# EAGLE board main_smd_smaller_draft (EAGLE 9.0.0)
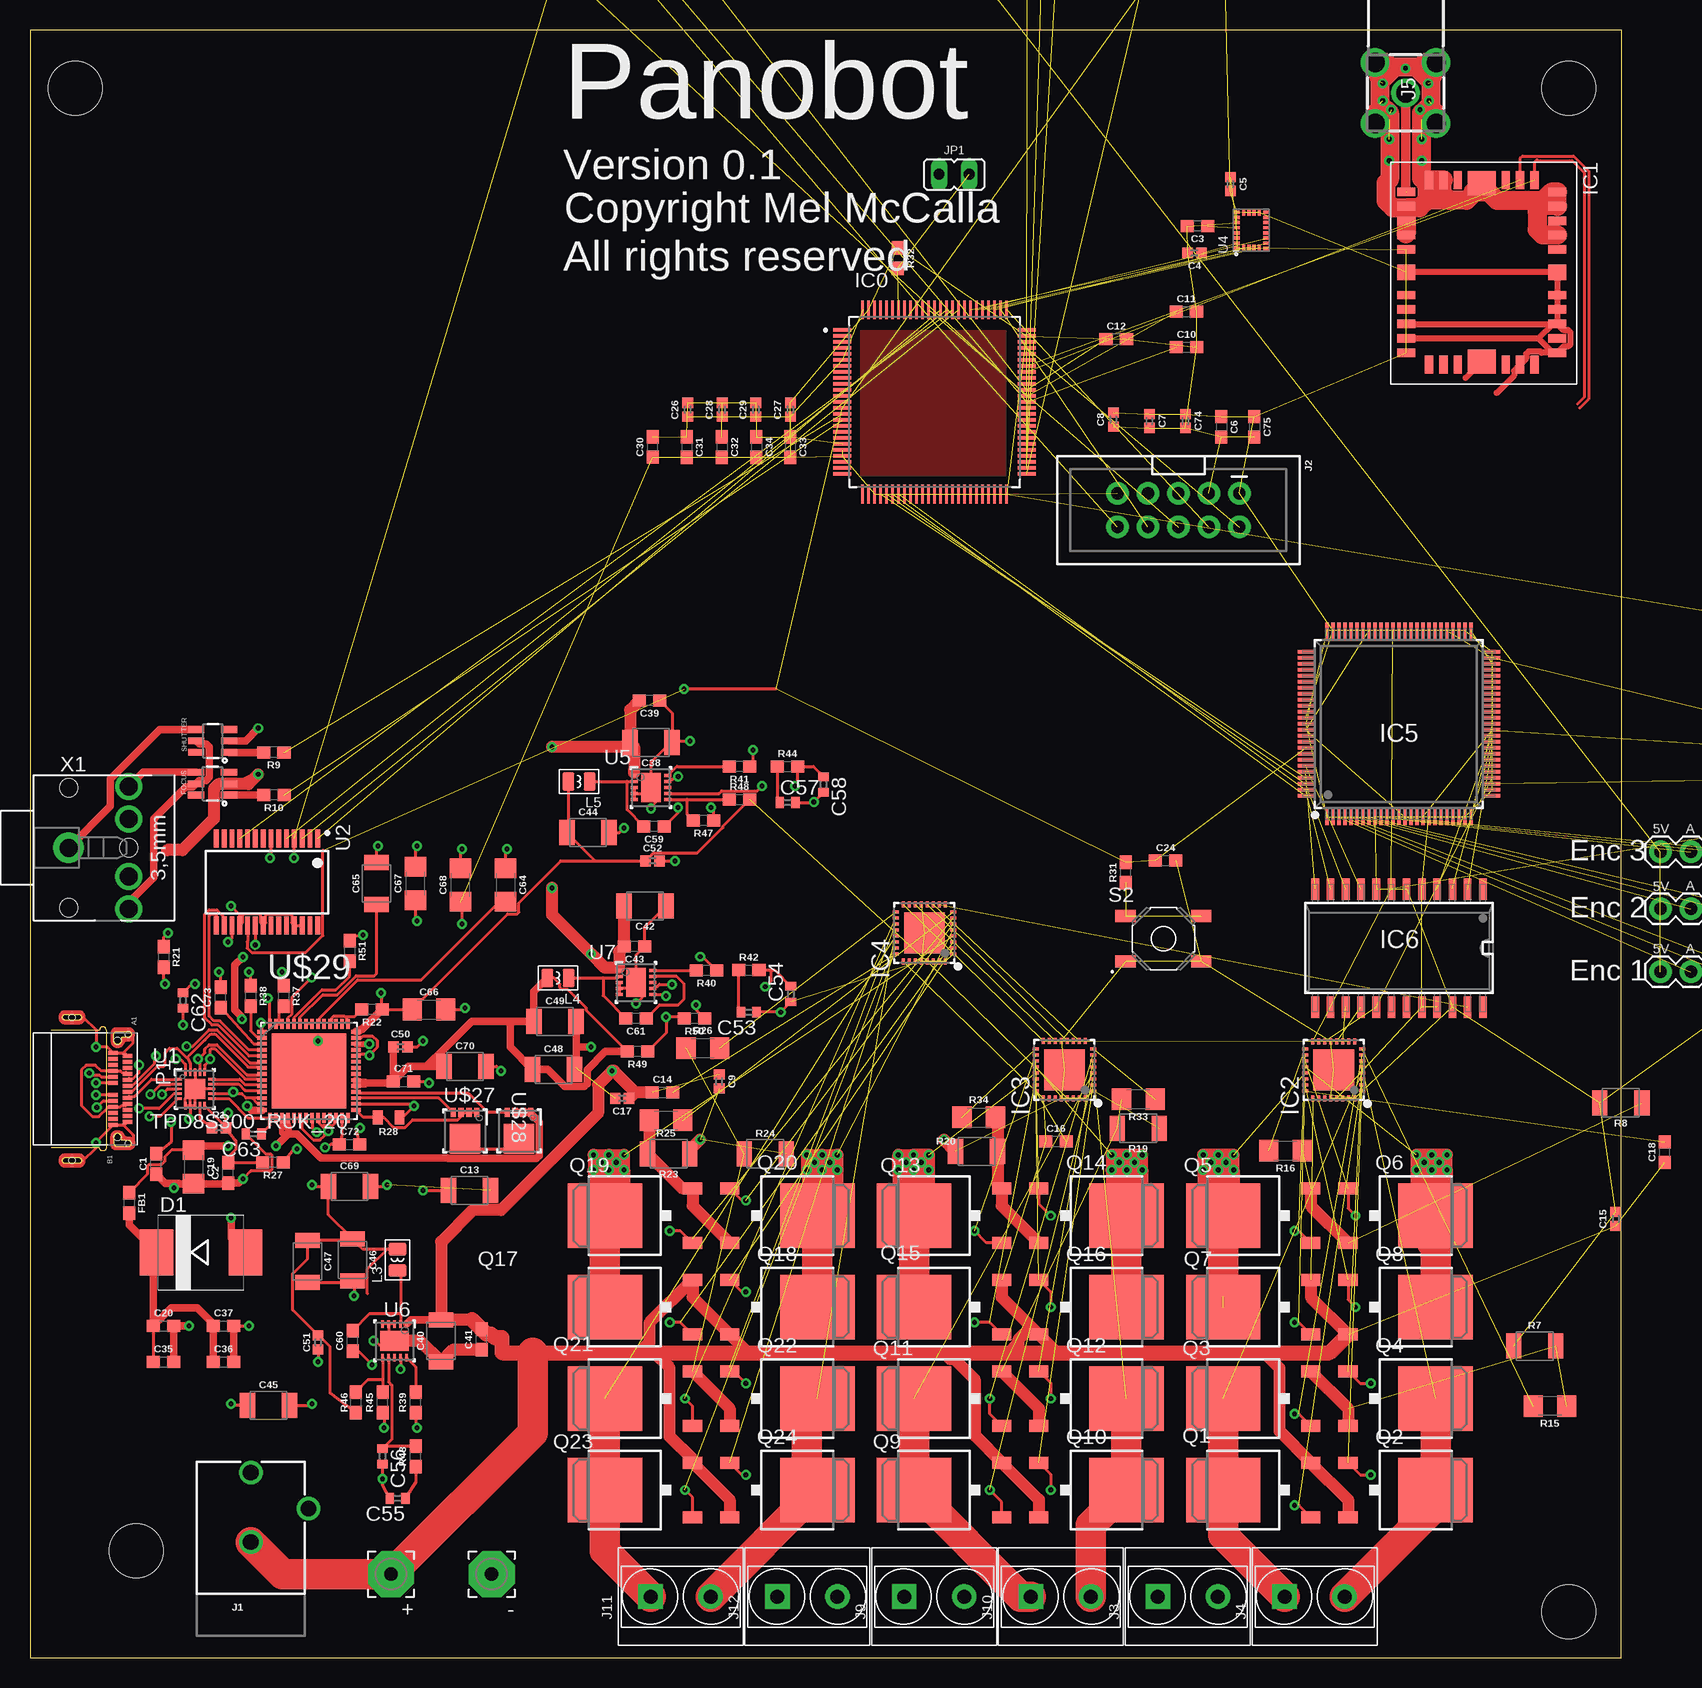
[diagram p9: board, top side]
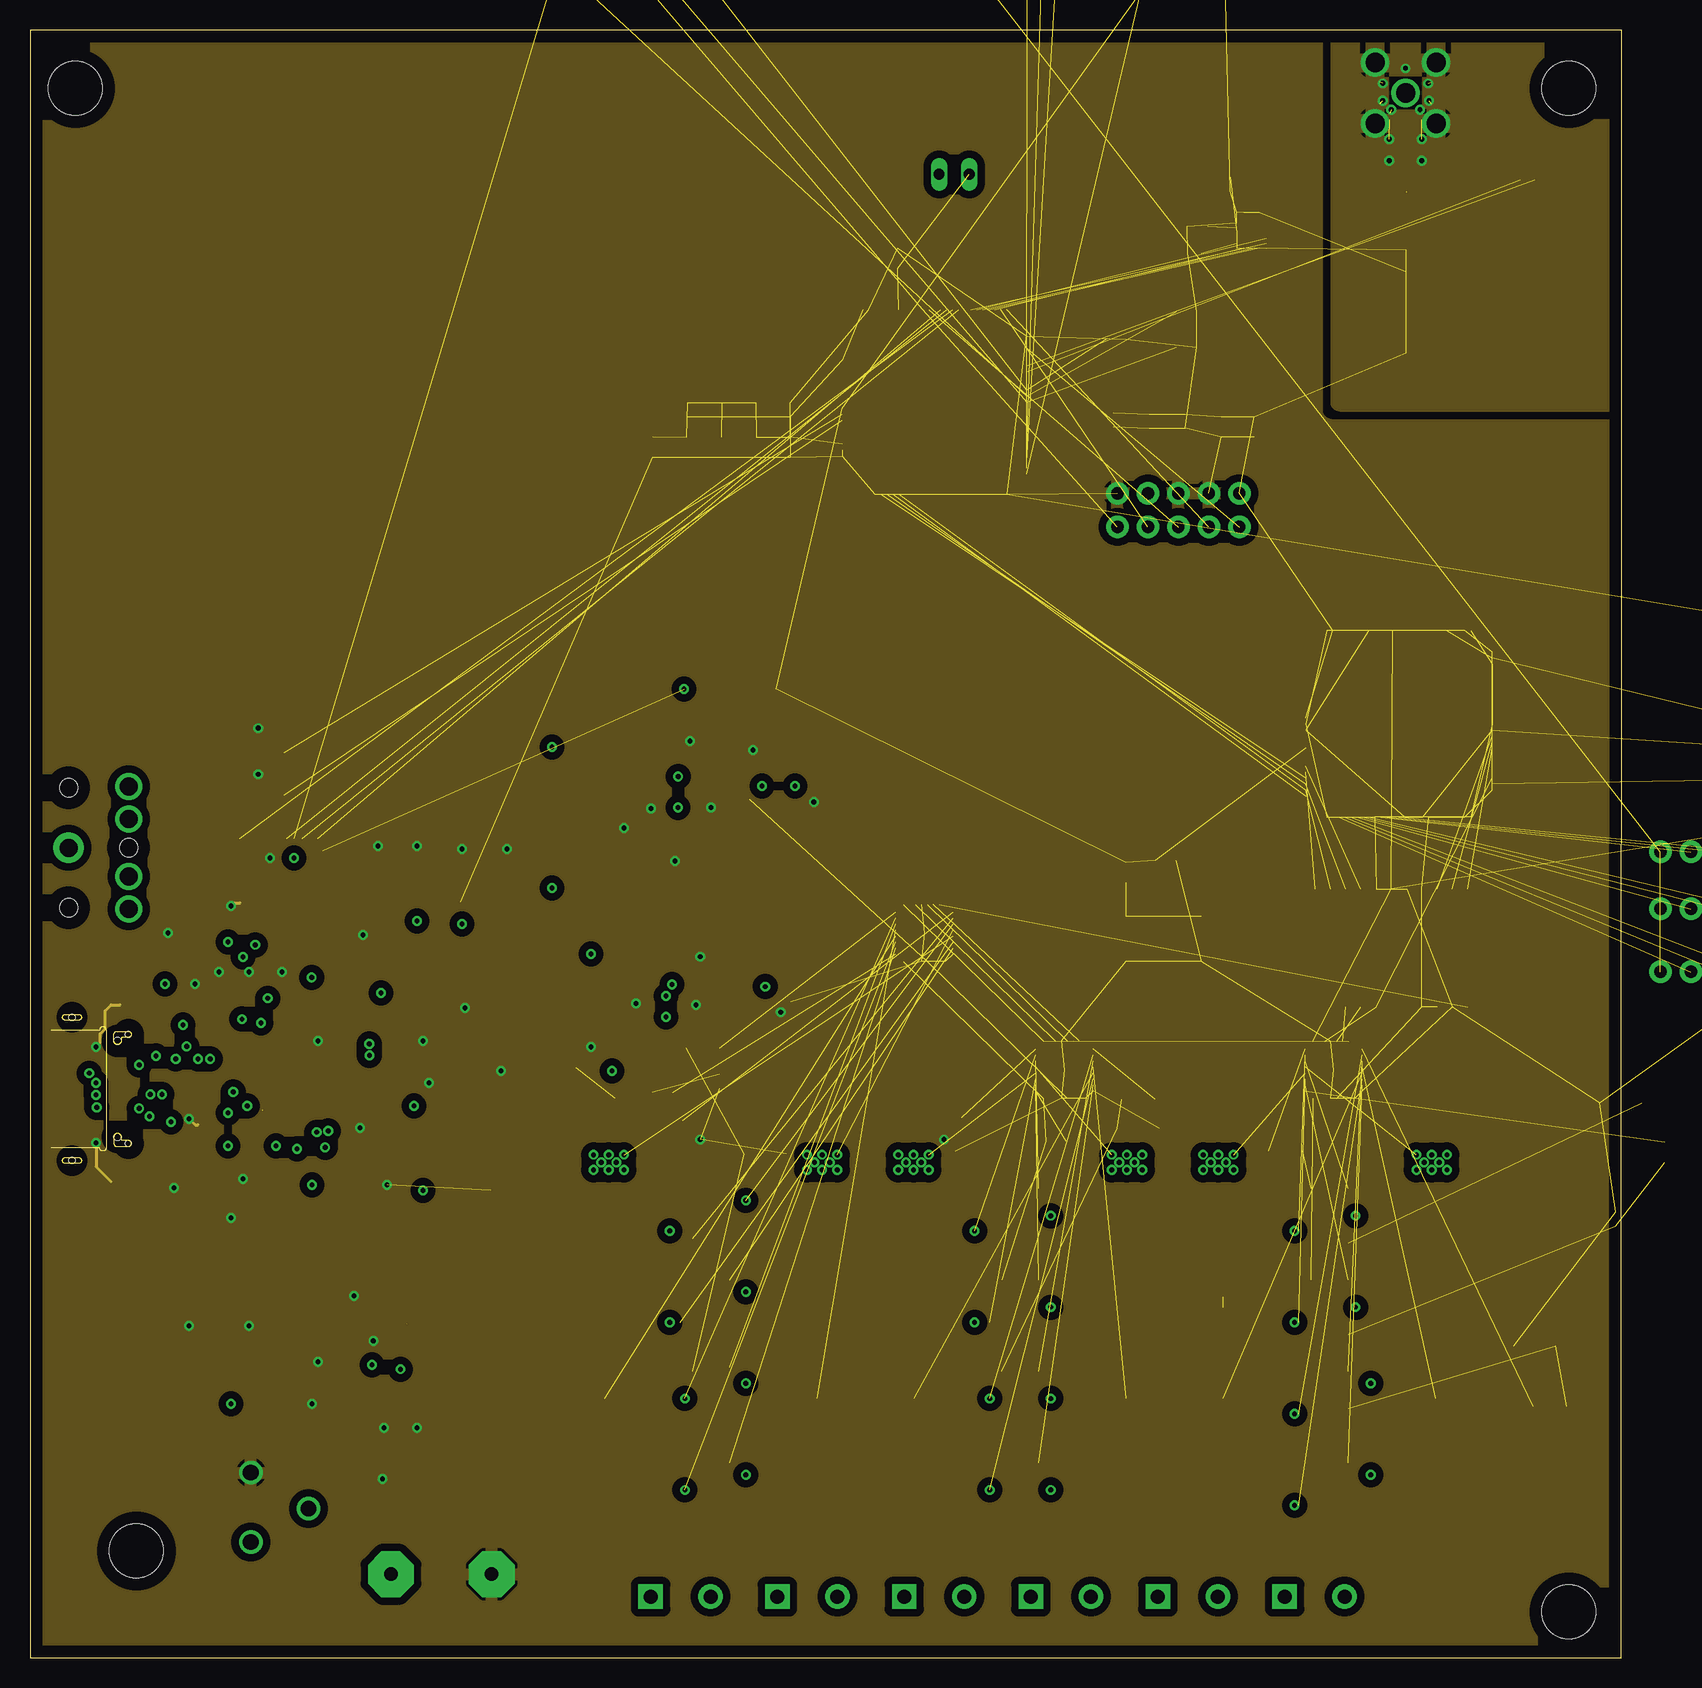
[diagram p10: board, inner layer Route2]
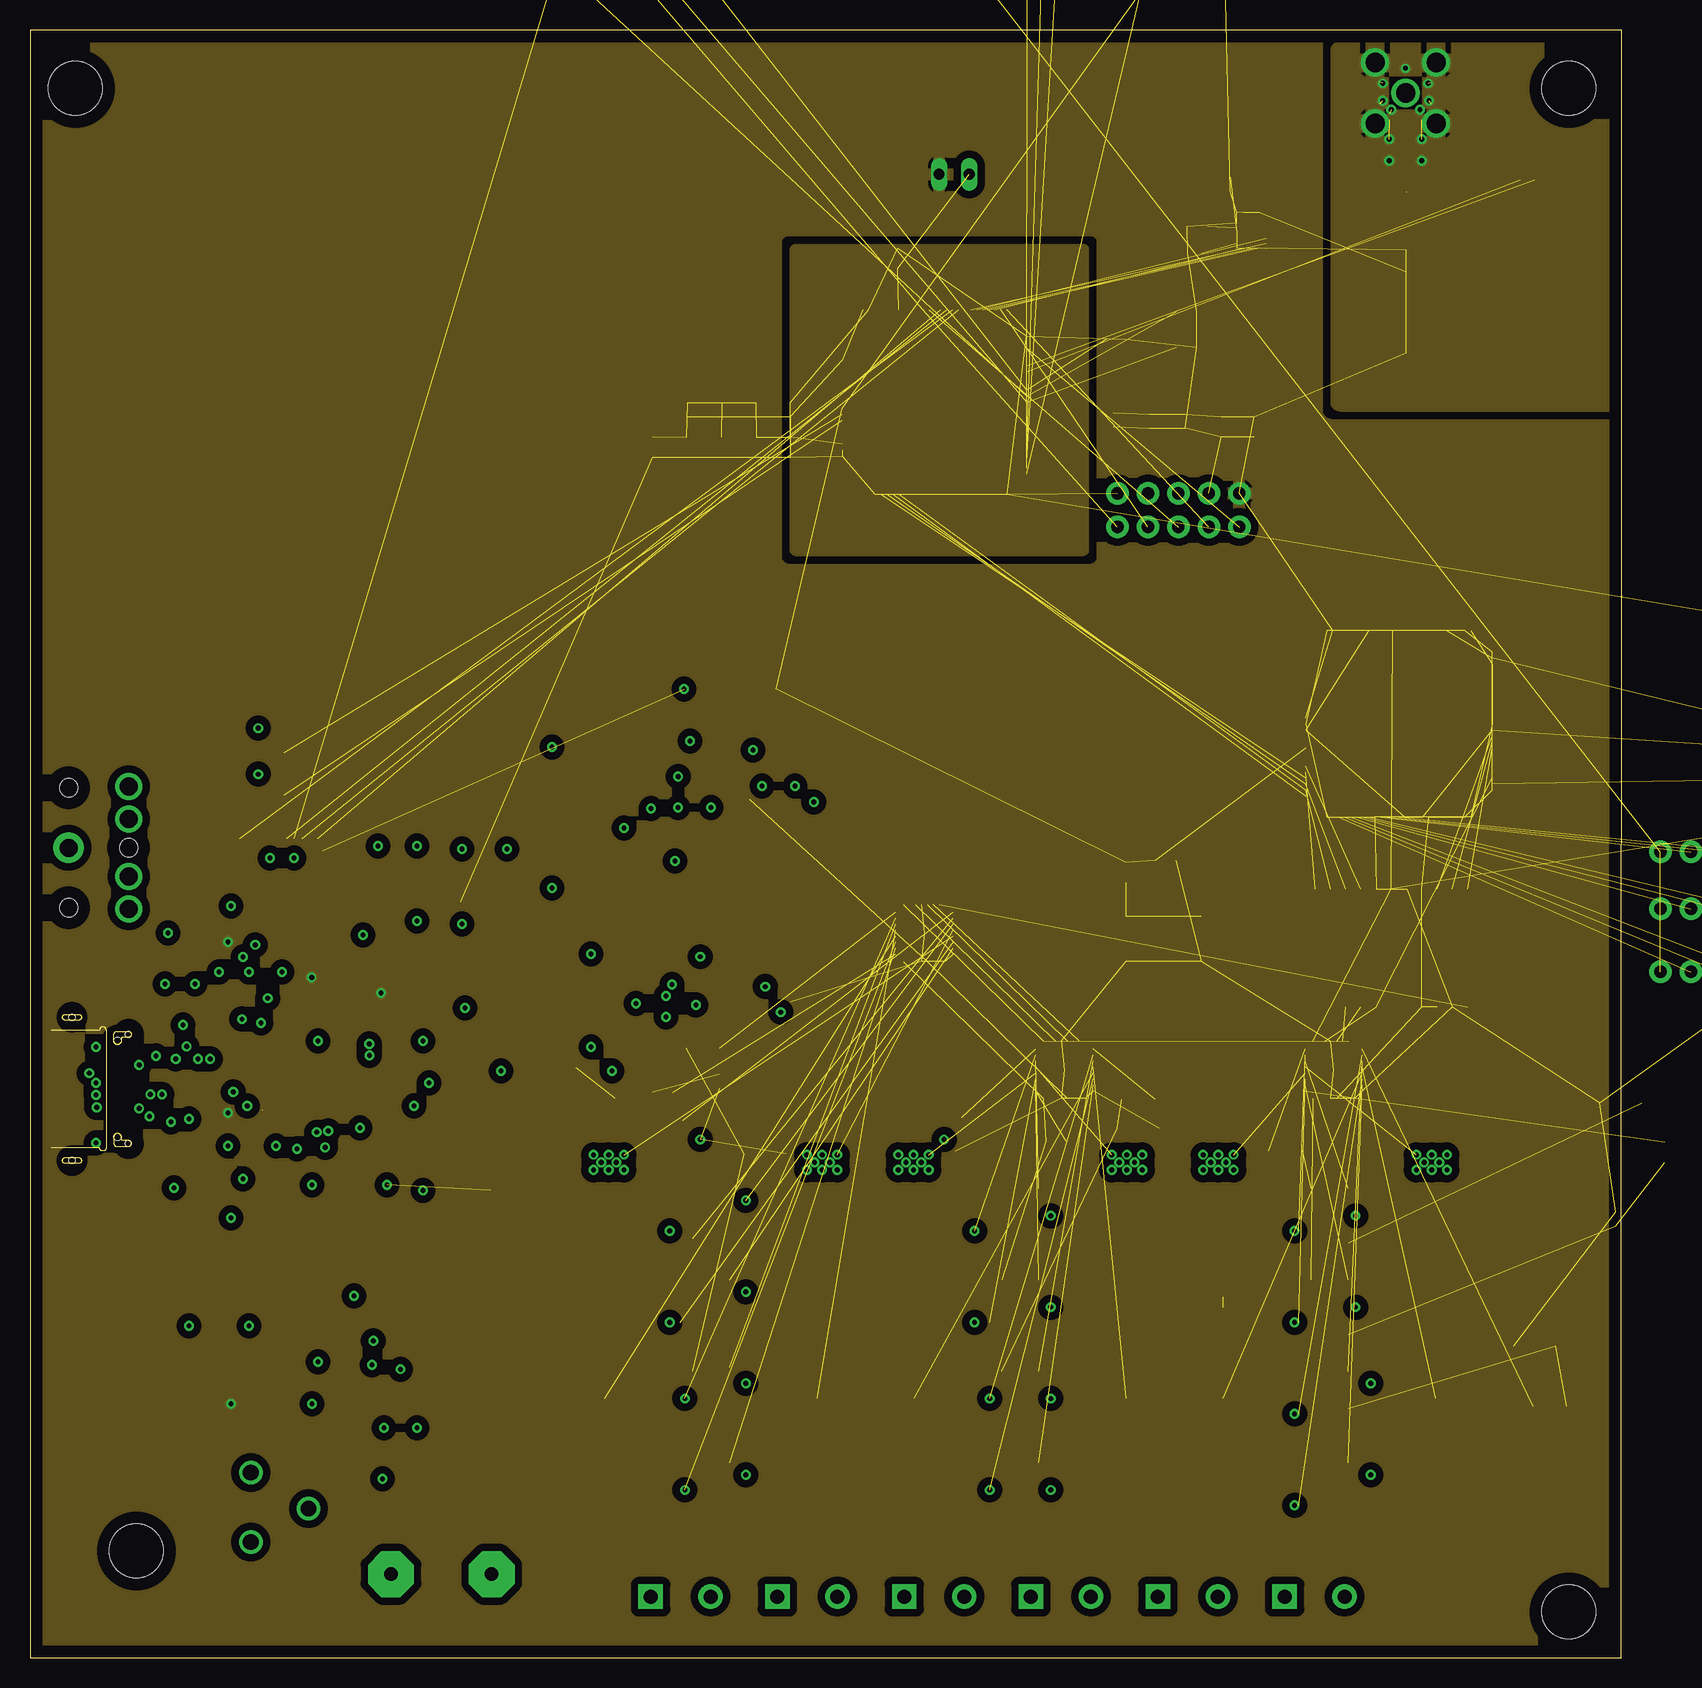
[diagram p11: board, inner layer Route3]
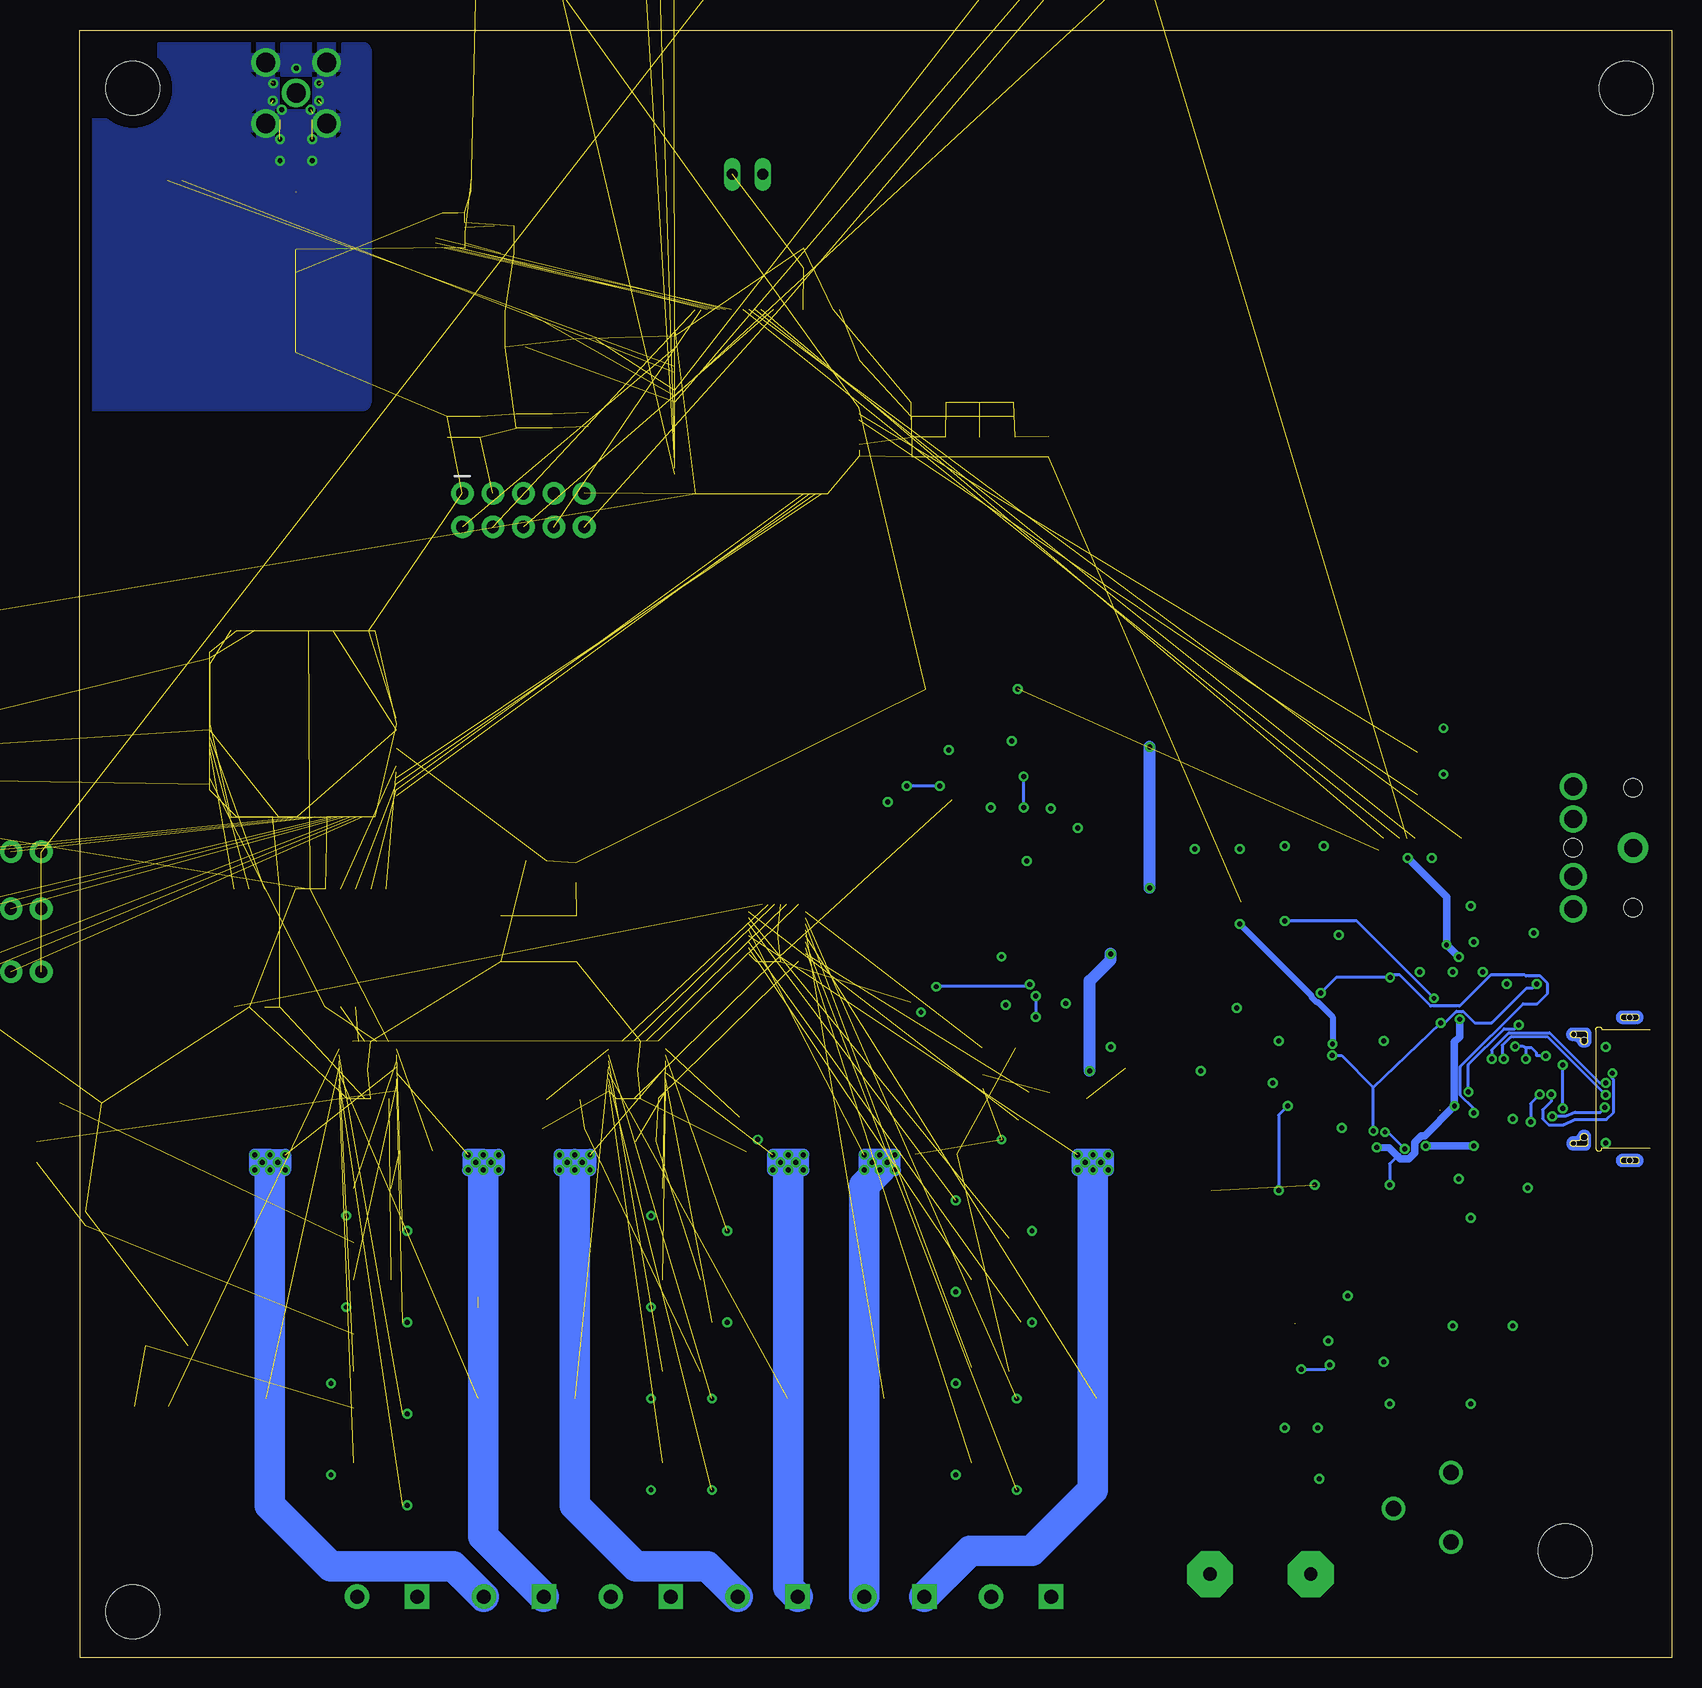
[diagram p12: board, bottom side, seen from below]

Size 132.66 x 135.67 mm. Coordinates in mm from the lower left corner, seen from the top.
Outline: 0,0 132.61,0 132.66,135.67 0,135.67 0,0
Copper layers (1+(2*3)+16): Top 0.035mm / dielectric 0.204mm / Route2 0.017mm / dielectric 0.252mm / Route3 0.017mm / dielectric 0.2mm / Bottom 0.035mm
Design rules "default *": minimum track width 3.5mil, minimum drill 16mil, track to track 3.5mil, track to pad 3.5mil, pad to pad 6mil, via to via 6mil, smd to smd 6mil, copper to edge 40mil, drill to drill 6mil, minimum pad ring 3mil, minimum via ring 8mil, stop-mask expansion 4mil, vias tented up to drill 0mil, thermal gap 10mil
Net classes: 1 differential: width 0.254 mm; 2 ground: width 0.254 mm; 3 power: width 0.254 mm; 4 rf: width 0.787 mm, clearance 0.152 mm; 5 rf_gnd: width 1.575 mm, clearance 0.152 mm
Holes 4.5 mm at 8.86,8.89 128.24,3.81 128.24,130.81 3.78,130.81

## Footprints (pad centres in the part's own frame; a part is rotated, then mirrored left to right if it is on the bottom)
3,81/1,1 = drill 1.118 pad 3.81 octagon: 1 0,0
0603 = smd 1.1 x 1: 1 -0.85,0; 2 0.85,0
0402 = smd 0.85 x 0.9: 1 -0.58,0; 2 0.58,0
1210 = smd 1.27 x 2.06: 1 -1.755,0; 2 1.755,0
1206 = smd 1.6 x 1.8: 1 -1.4,0; 2 1.4,0
C075-052X106 = drill 0.914 octagon: 1 -3.81,0; 2 3.81,0
085CS_1AR = smd 2.9 x 2.5: + 3.25,0; - -3.25,0
C0402 = smd 0.7 x 0.9: 1 -0.65,0; 2 0.65,0
SMC = smd 2.8 x 3.8: A 3.7,0; C -3.7,0
DO41-10 = drill 1.118: A 5.08,0; C -5.08,0
SOT23-6 = smd 0.55 x 1.35: 1 -0.95,-1.375; 2 0,-1.375; 3 0.95,-1.375; 4 0.95,1.375; 5 0,1.375; 6 -0.95,1.375
QFP50P1600X1600X160-100N = smd 1.56 x 0.28: 1 -7.68,6; 2 -7.68,5.5; 3 -7.68,5; 4 -7.68,4.5; 5 -7.68,4; 6 -7.68,3.5; 7 -7.68,3; 8 -7.68,2.5; 9 -7.68,2; 10 -7.68,1.5; 11 -7.68,1; 12 -7.68,0.5; 13 -7.68,0; 14 -7.68,-0.5; 15 -7.68,-1; 16 -7.68,-1.5; 17 -7.68,-2; 18 -7.68,-2.5; 19 -7.68,-3; 20 -7.68,-3.5; 21 -7.68,-4; 22 -7.68,-4.5; 23 -7.68,-5; 24 -7.68,-5.5; 25 -7.68,-6; 51 7.68,-6; 52 7.68,-5.5; 53 7.68,-5; 54 7.68,-4.5; 55 7.68,-4; 56 7.68,-3.5; 57 7.68,-3; 58 7.68,-2.5; 59 7.68,-2; 60 7.68,-1.5; 61 7.68,-1; 62 7.68,-0.5; 63 7.68,0; 64 7.68,0.5; 65 7.68,1; 66 7.68,1.5; 67 7.68,2; 68 7.68,2.5; 69 7.68,3; 70 7.68,3.5; 71 7.68,4; 72 7.68,4.5; 73 7.68,5; 74 7.68,5.5; 75 7.68,6 | smd 0.28 x 1.56: 26 -6,-7.68; 27 -5.5,-7.68; 28 -5,-7.68; 29 -4.5,-7.68; 30 -4,-7.68; 31 -3.5,-7.68; 32 -3,-7.68; 33 -2.5,-7.68; 34 -2,-7.68; 35 -1.5,-7.68; 36 -1,-7.68; 37 -0.5,-7.68; 38 0,-7.68; 39 0.5,-7.68; 40 1,-7.68; 41 1.5,-7.68; 42 2,-7.68; 43 2.5,-7.68; 44 3,-7.68; 45 3.5,-7.68; 46 4,-7.68; 47 4.5,-7.68; 48 5,-7.68; 49 5.5,-7.68; 50 6,-7.68; 76 6,7.68; 77 5.5,7.68; 78 5,7.68; 79 4.5,7.68; 80 4,7.68; 81 3.5,7.68; 82 3,7.68; 83 2.5,7.68; 84 2,7.68; 85 1.5,7.68; 86 1,7.68; 87 0.5,7.68; 88 0,7.68; 89 -0.5,7.68; 90 -1,7.68; 91 -1.5,7.68; 92 -2,7.68; 93 -2.5,7.68; 94 -3,7.68; 95 -3.5,7.68; 96 -4,7.68; 97 -4.5,7.68; 98 -5,7.68; 99 -5.5,7.68; 100 -6,7.68
S1315F8_SMT = smd 0.7 x 1.5: 1 -6.75,-6.2; 2 -5.55,-6.2; 3 -4.35,-6.2; 4 -3.15,-6.2; 5 -1.95,-6.2; 7 1.85,-6.2; 8 3.05,-6.2; 9 4.25,-6.2; 10 5.45,-6.2; 11 6.65,-6.2; 19 6.65,6.4; 20 5.45,6.4; 21 4.25,6.4; 22 3.05,6.4; 23 1.85,6.4; 25 -1.95,6.4; 26 -3.15,6.4; 27 -4.35,6.4; 28 -5.55,6.4; 29 -6.75,6.4 | smd 1.3 x 1.5: 6 -0.05,-6.2; 24 -0.05,6.4 | smd 1.5 x 0.7: 12 7.65,-4.3; 13 7.65,-3.1; 14 7.65,-1.9; 16 7.65,2.1; 17 7.65,3.3; 18 7.65,4.5; 30 -7.75,4.5; 31 -7.75,3.3; 32 -7.75,2.1; 34 -7.75,-1.9; 35 -7.75,-3.1; 36 -7.75,-4.3 | smd 2 x 2.3: 15 7.398,0.1; 33 -7.475,0.1
TMC_QFN32_0.5_5.0X5.0 = smd 0.254 x 0.5: 1 -1.75,-2.385; 2 -1.25,-2.385; 3 -0.75,-2.385; 4 -0.25,-2.385; 5 0.25,-2.385; 6 0.75,-2.385; 7 1.25,-2.385; 8 1.75,-2.385; 17 1.75,2.385; 18 1.25,2.385; 19 0.75,2.385; 20 0.25,2.385; 21 -0.25,2.385; 22 -0.75,2.385; 23 -1.25,2.385; 24 -1.75,2.385 | smd 0.5 x 0.254: 9 2.385,-1.75; 10 2.385,-1.25; 11 2.385,-0.75; 12 2.385,-0.25; 13 2.385,0.25; 14 2.385,0.75; 15 2.385,1.25; 16 2.385,1.75; 25 -2.385,1.75; 26 -2.385,1.25; 27 -2.385,0.75; 28 -2.385,0.25; 29 -2.385,-0.25; 30 -2.385,-0.75; 31 -2.385,-1.25; 32 -2.385,-1.75 | smd 3.4 x 3.4: 33 0,0
TMC_TQFP100_0.5_14X14 = smd 0.3 x 1.34: 1 -6,-7.773; 2 -5.5,-7.773; 3 -5,-7.773; 4 -4.5,-7.773; 5 -4,-7.773; 6 -3.5,-7.773; 7 -3,-7.773; 8 -2.5,-7.773; 9 -2,-7.773; 10 -1.5,-7.773; 11 -1,-7.773; 12 -0.5,-7.773; 13 0,-7.773; 14 0.5,-7.773; 15 1,-7.773; 16 1.5,-7.773; 17 2,-7.773; 18 2.5,-7.773; 19 3,-7.773; 20 3.5,-7.773; 21 4,-7.773; 22 4.5,-7.773; 23 5,-7.773; 24 5.5,-7.773; 25 6,-7.773; 51 6,7.773; 52 5.5,7.773; 53 5,7.773; 54 4.5,7.773; 55 4,7.773; 56 3.5,7.773; 57 3,7.773; 58 2.5,7.773; 59 2,7.773; 60 1.5,7.773; 61 1,7.773; 62 0.5,7.773; 63 0,7.773; 64 -0.5,7.773; 65 -1,7.773; 66 -1.5,7.773; 67 -2,7.773; 68 -2.5,7.773; 69 -3,7.773; 70 -3.5,7.773; 71 -4,7.773; 72 -4.5,7.773; 73 -5,7.773; 74 -5.5,7.773; 75 -6,7.773 | smd 1.34 x 0.3: 26 7.773,-6; 27 7.773,-5.5; 28 7.773,-5; 29 7.773,-4.5; 30 7.773,-4; 31 7.773,-3.5; 32 7.773,-3; 33 7.773,-2.5; 34 7.773,-2; 35 7.773,-1.5; 36 7.773,-1; 37 7.773,-0.5; 38 7.773,0; 39 7.773,0.5; 40 7.773,1; 41 7.773,1.5; 42 7.773,2; 43 7.773,2.5; 44 7.773,3; 45 7.773,3.5; 46 7.773,4; 47 7.773,4.5; 48 7.773,5; 49 7.773,5.5; 50 7.773,6; 76 -7.773,6; 77 -7.773,5.5; 78 -7.773,5; 79 -7.773,4.5; 80 -7.773,4; 81 -7.773,3.5; 82 -7.773,3; 83 -7.773,2.5; 84 -7.773,2; 85 -7.773,1.5; 86 -7.773,1; 87 -7.773,0.5; 88 -7.773,0; 89 -7.773,-0.5; 90 -7.773,-1; 91 -7.773,-1.5; 92 -7.773,-2; 93 -7.773,-2.5; 94 -7.773,-3; 95 -7.773,-3.5; 96 -7.773,-4; 97 -7.773,-4.5; 98 -7.773,-5; 99 -7.773,-5.5; 100 -7.773,-6
TMC_SO24_SOT137-1_1.27_15.5X7.5 = smd 0.63 x 1.8: 1 -6.985,-4.912; 2 -5.715,-4.912; 3 -4.445,-4.912; 4 -3.175,-4.912; 5 -1.905,-4.912; 6 -0.635,-4.912; 7 0.635,-4.912; 8 1.905,-4.912; 9 3.175,-4.912; 10 4.445,-4.912; 11 5.715,-4.912; 12 6.985,-4.912; 13 6.985,4.912; 14 5.715,4.912; 15 4.445,4.912; 16 3.175,4.912; 17 1.905,4.912; 18 0.635,4.912; 19 -0.635,4.912; 20 -1.905,4.912; 21 -3.175,4.912; 22 -4.445,4.912; 23 -5.715,4.912; 24 -6.985,4.912
SOT223 = smd 1.5 x 2: 1 -2.3,-3.15; 2 0,-3.15; 3 2.3,-3.15 | smd 3.8 x 2: 4 0,3.15
POWER_JACK_PTH_BREAD = drill 1.3: GND 0,7.9; GNDBREAK 4.8,10.7; PWR 0,13.7
2X5-SHROUDED_LOCK = drill 1.016 pad 1.88: 1 -1.397,5.08; 2 1.397,5.08; 3 -1.397,2.54; 4 1.397,2.54; 5 -1.397,0; 6 1.397,0; 7 -1.397,-2.54; 8 1.397,-2.54; 9 -1.397,-5.08; 10 1.397,-5.08
H2-5.0-10.5X8.0MM = drill 1.168 pad 2.032 square: 1 0,2.5 | drill 1.168 pad 2.032: 2 0,-2.5
73100-0114 = drill 1.59 pad 2.39: 1 0,0; 2 -2.54,2.54; 3 2.54,2.54; 4 2.54,-2.54; 5 -2.54,-2.54
1X05 = drill 1.016 pad 1.88: 1 0,0; 2 2.54,0; 3 5.08,0; 4 7.62,0; 5 10.16,0
JP1 = drill 0.914 long: 1 0,-1.27; 2 0,1.27
L0806 = smd 1.016 x 1.524: 1 -0.889,0; 2 0.889,0
TE_1-2295018-2 = smd 0.3 x 0.8: A1 -2.75,4.63; A2 -2.25,4.63; A3 -1.75,4.63; A4 -1.25,4.63; A5 -0.75,4.63; A6 -0.25,4.63; A7 0.25,4.63; A8 0.75,4.63; A9 1.25,4.63; A10 1.75,4.63; A11 2.25,4.63; A12 2.75,4.63; B1 3,3.43; B2 2.5,3.43; B3 2,3.43; B4 1.5,3.43; B5 1,3.43; B6 0.5,3.43; B7 -0.5,3.43; B8 -1,3.43; B9 -1.5,3.43; B10 -2,3.43; B11 -2.5,3.43; B12 -3,3.43 | smd 0.1 x 0.1: S1 -4.6,5.1; S2 4.6,5.1; S3 6,0.9; S4 -6,0.9 | hole 0.5: -4.55,4.695; 4.55,4.695; -5.97,0; 5.97,0 | hole 0.6: -4,3.795; 4,3.795
TO252 = smd 5.4 x 6.2: C 0,2.5 | smd 1 x 1.6: L -2.28,-4.8; R 2.28,-4.8
0805 = smd 0.8 x 1.2: 1 -0.9,0; 2 0.9,0
M0805 = smd 1.3 x 1.6: 1 -0.95,0; 2 0.95,0
EN11HSM1BF20 = drill 1.15 pad 1.725: 1 -2.5,-7.5; 2 0,-7.5; 3 2.5,-7.5; 4 -2.5,7.5; 5 2.5,7.5 | drill 3.162 pad 4.743: 6 -4.65,0; 7 4.65,0
SW_TL3342F160QG = smd 1.7 x 1: 1 -3.15,-1.9; 2 3.15,-1.9; 3 -3.15,1.9; 4 3.15,1.9
SIP-20 = drill 0.6 pad 0.7 long: 1 -2.5,0; 2 -1.25,0; 3 0,0; 4 1.25,0; 5 2.5,0; 6 3.85,0; 7 5.1,0; 8 6.35,0; 9 7.6,0; 10 8.85,0; 11 10.2,0; 12 11.45,0; 13 12.7,0; 14 13.95,0; 15 15.2,0; 16 16.55,0; 17 17.8,0; 18 19.05,0; 19 20.3,0; 20 21.55,0
RUK0020B_NV = smd 0.6 x 0.2: 1 -1.4,0.8; 2 -1.4,0.4; 3 -1.4,0; 4 -1.4,-0.4; 5 -1.4,-0.8; 11 1.4,-0.8; 12 1.4,-0.4; 13 1.4,0; 14 1.4,0.4; 15 1.4,0.8 | smd 0.2 x 0.6: 6 -0.8,-1.4; 7 -0.4,-1.4; 8 0,-1.4; 9 0.4,-1.4; 10 0.8,-1.4; 16 0.8,1.4; 17 0.4,1.4; 18 0,1.4; 19 -0.4,1.4; 20 -0.8,1.4 | smd 1.7 x 1.7: 21 0,0
SOP65P780X200-28N = smd 1.5 x 0.4: 1 -3.625,4.225; 2 -3.625,3.575; 3 -3.625,2.925; 4 -3.625,2.275; 5 -3.625,1.625; 6 -3.625,0.975; 7 -3.625,0.325; 8 -3.625,-0.325; 9 -3.625,-0.975; 10 -3.625,-1.625; 11 -3.625,-2.275; 12 -3.625,-2.925; 13 -3.625,-3.575; 14 -3.625,-4.225; 15 3.625,-4.225; 16 3.625,-3.575; 17 3.625,-2.925; 18 3.625,-2.275; 19 3.625,-1.625; 20 3.625,-0.975; 21 3.625,-0.325; 22 3.625,0.325; 23 3.625,0.975; 24 3.625,1.625; 25 3.625,2.275; 26 3.625,2.925; 27 3.625,3.575; 28 3.625,4.225
SOP65P640X120-8N = smd 1.473 x 0.356: 1 -2.921,0.965; 2 -2.921,0.33; 3 -2.921,-0.33; 4 -2.921,-0.965; 5 2.921,-0.965; 6 2.921,-0.33; 7 2.921,0.33; 8 2.921,0.965
PQFN24P43_350X300X102L35X23N = smd 0.28 x 0.53: 1 -1.505,1.225; 6 -1.505,-1.225; 7 -1.075,-1.225; 8 -0.645,-1.225; 9 -0.215,-1.225; 10 0.215,-1.225; 11 0.645,-1.225; 12 1.075,-1.225; 13 1.505,-1.225; 18 1.505,1.225; 19 1.075,1.225; 20 0.645,1.225; 21 0.215,1.225; 22 -0.215,1.225; 23 -0.645,1.225; 24 -1.075,1.225 | smd 0.53 x 0.28: 2 -1.47,0.645; 3 -1.47,0.215; 4 -1.47,-0.215; 5 -1.47,-0.645; 14 1.47,-0.645; 15 1.47,-0.215; 16 1.47,0.215; 17 1.47,0.645
DRC0010J = smd 0.6 x 0.24: 1 -1.4,1; 2 -1.4,0.5; 3 -1.4,0; 4 -1.4,-0.5; 5 -1.4,-1; 6 1.4,-1; 7 1.4,-0.5; 8 1.4,0; 9 1.4,0.5; 10 1.4,1 | smd 1.65 x 2.4: 11 0,0 | smd 0.5 x 0.5: V 0,-0.95
DQG0008A = smd 0.75 x 0.44: 1 -1.525,0.975; 2 -1.525,0.325; 3 -1.525,-0.325; 4 -1.525,-0.975; 5 1.525,-0.975; 6 1.525,-0.325; 7 1.525,0.325; 8 1.525,0.975 | smd 2.5 x 2.55: 9 0.65,0 | smd 0.5 x 0.5: V 0.226,0.975
QFN50P800X800X100-57N = smd 0.813 x 0.305: 1 -3.912,3.251; 2 -3.912,2.743; 3 -3.912,2.261; 4 -3.912,1.753; 5 -3.912,1.245; 6 -3.912,0.762; 7 -3.912,0.254; 8 -3.912,-0.254; 9 -3.912,-0.762; 10 -3.912,-1.245; 11 -3.912,-1.753; 12 -3.912,-2.261; 13 -3.912,-2.743; 14 -3.912,-3.251; 29 3.912,-3.251; 30 3.912,-2.743; 31 3.912,-2.261; 32 3.912,-1.753; 33 3.912,-1.245; 34 3.912,-0.762; 35 3.912,-0.254; 36 3.912,0.254; 37 3.912,0.762; 38 3.912,1.245; 39 3.912,1.753; 40 3.912,2.261; 41 3.912,2.743; 42 3.912,3.251 | smd 0.305 x 0.813: 15 -3.251,-3.912; 16 -2.743,-3.912; 17 -2.261,-3.912; 18 -1.753,-3.912; 19 -1.245,-3.912; 20 -0.762,-3.912; 21 -0.254,-3.912; 22 0.254,-3.912; 23 0.762,-3.912; 24 1.245,-3.912; 25 1.753,-3.912; 26 2.261,-3.912; 27 2.743,-3.912; 28 3.251,-3.912; 43 3.251,3.912; 44 2.743,3.912; 45 2.261,3.912; 46 1.753,3.912; 47 1.245,3.912; 48 0.762,3.912; 49 0.254,3.912; 50 -0.254,3.912; 51 -0.762,3.912; 52 -1.245,3.912; 53 -1.753,3.912; 54 -2.261,3.912; 55 -2.743,3.912; 56 -3.251,3.912 | smd 6.248 x 6.248: 57 0,0
STX3100 = drill 1.5 pad 2.54: 1 2.7,-0.1 | drill 1.5: 2 7.7,5; 3 7.7,2.3; 4 7.7,-2.5; 5 7.7,-5.2 | hole 1.5: 2.7,4.9; 2.7,-5.1; 7.7,-0.1
7B-16.000MAAJ-T_OSCSC500X320X105-4N = smd 1.2 x 2: 1 -1.1,1.85; 2 -1.1,-1.85; 3 1.1,-1.85; 4 1.1,1.85

## Placement (x,y rotation side)
+  [3,81/1,1]  30.08,6.95 180 top
-  [3,81/1,1]  38.47,6.95 180 top
C1  0.1uF  [0603]  10.5,41.15 90 top
C2  1.0uF  [0603]  16.5,40.4 90 top
C3  10nF  [0603]  97.29,119.33 180 top
C4  0.1uF  [0402]  97.04,117.08 180 top
C5  0.1uF  [0402]  100.04,122.83 270 top
C6  10uF  [0603]  99.29,102.58 270 top
C7  0.1uF  [0402]  93.29,103.08 270 top
C8  470nF  [0402]  90.29,103.2 90 top
C9  0.1uF  [0402]  57.43,48.02 270 top
C10  10nF  [0603]  96.37,109.22 0 top
C11  10nF  [0603]  96.36,112.19 0 top
C12  10nF  [0603]  90.52,109.91 0 top
C13  10uF  [1210]  36.62,38.94 0 top
C14  0.22uF  [0603]  52.7,47.12 0 top
C15  0.1uF  [0402]  132.15,36.56 90 top
C16  0.22uF  [0603]  85.5,43.03 0 top
C17  0.1uF  [0402]  49.34,46.61 180 top
C18  0.22uF  [0603]  136.24,42.13 90 top  (outside the outline)
C19  1.0uF  [1206]  13.62,40.9 270 top
C20  10nF  [0603]  11.12,27.65 0 top
C21  0.1uF  [C075-052X106]  149.87,96.89 0 top  (outside the outline)
C22  1uF  [085CS_1AR]  158.44,74.76 180 top  (outside the outline)
C23  10uF  [085CS_1AR]  162.51,80.24 180 top  (outside the outline)
C24  10nF  [0603]  94.63,66.43 0 top
C25  10nF  [0603]  47.97,142.32 180 top  (outside the outline)
C26  0.1uF  [0402]  54.81,104.01 90 top
C27  0.1uF  [0402]  63.37,104.01 90 top
C28  0.1uF  [0402]  57.68,104.01 90 top
C29  0.1uF  [0402]  60.49,104.01 90 top
C30  4.7uF  [0603]  51.9,100.91 90 top
C31  10nF  [0603]  54.72,100.9 270 top
C32  10nF  [0603]  57.66,100.9 270 top
C33  0.1uF  [0603]  63.35,100.9 270 top
C34  0.1uF  [0603]  60.54,100.9 270 top
C35  10nF  [0603]  11.12,24.65 0 top
C36  10nF  [0603]  16.12,24.65 0 top
C37  10nF  [0603]  16.12,27.65 0 top
C38  10uF  [1210]  51.75,76.27 180 top
C39  0.1uF  [0603]  51.62,79.77 180 top
C40  10uF  [1210]  34.25,26.4 90 top
C41  0.1uF  [0603]  37.62,26.52 90 top
C42  10uF  [1210]  51.25,62.65 180 top
C43  0.1uF  [0603]  50.38,59.28 180 top
C44  22UF-1210-16V-20%  [1210]  46.5,68.77 0 top
C45  22UF-1210-16V-20%  [1210]  19.88,21.02 0 top
C46  22UF-1210-16V-20%  [1210]  26.88,33.15 270 top
C47  22UF-1210-16V-20%  [1210]  23.12,33.02 270 top
C48  22UF-1210-16V-20%  [1210]  43.62,49.03 0 top
C49  22UF-1210-16V-20%  [1210]  43.75,53.03 0 top
C50  0.1uF  [0402]  30.88,50.9 0 top
C51  0.1uF  [0402]  24,26.27 270 top
C52  0.1uF  [0402]  51.88,66.4 0 top
C53  1800pF  [C0402]  59.91,53.8 180 top
C54  91pF  [C0402]  63.41,55.3 90 top
C55  2200pF  [C0402]  30.62,13.28 180 top
C56  100pF  [C0402]  29.38,16.78 270 top
C57  5600pF  [C0402]  63.12,71.27 0 top
C58  330pF  [C0402]  66.12,72.77 270 top
C59  0.1uF  [0603]  52,69.27 180 top
C60  0.1uF  [0603]  26.88,26.4 90 top
C61  0.1uF  [0603]  50.5,53.28 180 top
C62  220pF  [C0402]  12.75,54.78 270 top
C63  220pF  [C0402]  18.62,43.65 180 top
C64  1.0uF  [1206]  39.62,64.4 270 top
C65  10uF  [1210]  28.88,64.53 90 top
C66  1.0uF  [1206]  33.25,54.03 0 top
C67  1.0uF  [1206]  32.12,64.53 90 top
C68  1.0uF  [1206]  35.88,64.4 90 top
C69  22UF-1210-16V-20%  [1210]  26.62,39.28 0 top
C70  10uF  [1210]  36.25,49.28 0 top
C71  0.1uF  [0603]  31.12,48.03 0 top
C72  0.1uF  [0603]  26.62,42.78 0 top
C73  0.22uF  [0603]  15.88,55.03 90 top
C74  1.0uF  [0402]  96.29,103.08 270 top
C75  10nF  [0603]  102.04,102.58 270 top
D1  MBRS340T3  [SMC]  14.25,33.78 0 top
D2  1N4002  [DO41-10]  149.66,86.43 0 top  (outside the outline)
D3  1N4002  [DO41-10]  149.66,90.65 0 top  (outside the outline)
FB1  30Ω/1.8A  [0603]  8.25,37.9 270 top
FOCUS  4N35S  [SOT23-6]  15.21,72.85 90 top
IC0  STM32F313VCT6  [QFP50P1600X1600X160-100N]  75.38,104.66 0 top
IC1  S1315F8_RAW  [S1315F8_SMT]  120.88,115.42 270 top
IC2  TMC262-LA  [TMC_QFN32_0.5_5.0X5.0]  108.65,48.98 90 top
IC3  TMC262-LA  [TMC_QFN32_0.5_5.0X5.0]  86.2,49 90 top
IC4  TMC262-LA  [TMC_QFN32_0.5_5.0X5.0]  74.53,60.41 90 top
IC5  TMC424  [TMC_TQFP100_0.5_14X14]  114.07,77.83 0 top
IC6  TMC429-PI24  [TMC_SO24_SOT137-1_1.27_15.5X7.5]  114.09,59.14 180 top
IC8  LM317MBSTT3  [SOT223]  148.09,78.75 180 top  (outside the outline)
J1  POWER_JACKPTH_BREAD  [POWER_JACK_PTH_BREAD]  18.4,1.72 0 top
J2  [2X5-SHROUDED_LOCK]  95.7,95.65 270 top
J3  Motor Coil B  [H2-5.0-10.5X8.0MM]  96.49,5.08 90 top
J4  Motor Coil A  [H2-5.0-10.5X8.0MM]  107.05,5.08 90 top
J5  73100-0114  [73100-0114]  114.63,130.42 270 top
J8  [1X05]  146.03,67.17 180 top  (outside the outline)
J9  Motor Coil B  [H2-5.0-10.5X8.0MM]  75.35,5.08 90 top
J10  Motor Coil A  [H2-5.0-10.5X8.0MM]  85.91,5.08 90 top
J11  Motor Coil B  [H2-5.0-10.5X8.0MM]  54.22,5.08 90 top
J12  Motor Coil A  [H2-5.0-10.5X8.0MM]  64.78,5.08 90 top
J13  [1X05]  146.03,62.42 180 top  (outside the outline)
J14  [1X05]  146.03,57.17 180 top  (outside the outline)
JP1  [JP1]  77.02,123.63 90 top
L3  10UH-225MA  [L0806]  30.62,33.15 90 top
L4  10UH-225MA  [L0806]  44,56.65 180 top
L5  10UH-225MA  [L0806]  45.75,73.02 180 top
P1  1-2295018-2  [TE_1-2295018-2]  3.5,47.4 270 top
Q1  AOD4189  [TO252]  101.94,13.97 90 top
Q2  AOD4189  [TO252]  114.64,13.97 270 top
Q3  AOD4184A  [TO252]  101.94,21.59 90 top
Q4  AOD4184A  [TO252]  114.64,21.59 270 top
Q5  AOD4184A  [TO252]  101.94,36.83 90 top
Q6  AOD4184A  [TO252]  114.64,36.83 270 top
Q7  AOD4189  [TO252]  101.94,29.21 90 top
Q8  AOD4189  [TO252]  114.64,29.21 270 top
Q9  AOD4189  [TO252]  76.17,13.97 90 top
Q10  AOD4189  [TO252]  88.87,13.97 270 top
Q11  AOD4184A  [TO252]  76.17,21.59 90 top
Q12  AOD4184A  [TO252]  88.87,21.59 270 top
Q13  AOD4184A  [TO252]  76.17,36.83 90 top
Q14  AOD4184A  [TO252]  88.87,36.83 270 top
Q15  AOD4189  [TO252]  76.17,29.21 90 top
Q16  AOD4189  [TO252]  88.87,29.21 270 top
Q17  AOD4189  [TO252]  50.41,29.21 90 top
Q18  AOD4189  [TO252]  63.11,29.21 270 top
Q19  AOD4184A  [TO252]  50.41,36.83 90 top
Q20  AOD4184A  [TO252]  63.11,36.83 270 top
Q21  AOD4184A  [TO252]  50.41,21.59 90 top
Q22  AOD4184A  [TO252]  63.11,21.59 270 top
Q23  AOD4189  [TO252]  50.41,13.97 90 top
Q24  AOD4189  [TO252]  63.11,13.97 270 top
R1  100K  [0402]  15.75,44.15 0 top
R6  10k  [0603]  181.96,68.85 180 top  (outside the outline)
R7  0.1  [1210]  125.39,25.98 0 top
R8  0.1  [1210]  132.57,46.24 180 top
R9  220  [0603]  20.32,75.46 180 top
R10  220  [0603]  20.33,71.9 180 top
R11  10k  [0603]  43.82,143.61 0 top  (outside the outline)
R12  10k  [0603]  43.89,146.39 0 top  (outside the outline)
R13  10k  [0603]  43.88,140.52 180 top  (outside the outline)
R14  10k  [0603]  43.74,149.64 0 top  (outside the outline)
R15  10  [1206]  126.66,20.96 180 top
R16  10  [1206]  104.63,42.24 180 top
R17  10k  [0603]  43.77,155.05 180 top  (outside the outline)
R18  10k  [0603]  43.94,152.26 0 top  (outside the outline)
R19  0.1  [1210]  92.35,44.11 180 top
R20  0.1  [1210]  78.87,42.19 180 top
R21  1M  [0603]  11.12,58.4 270 top
R22  10k  [0603]  28.5,54.03 180 top
R23  0.1  [1210]  53.22,41.99 180 top
R24  0.1  [1210]  61.28,41.99 0 top
R25  10  [1206]  53,44.8 0 top
R26  10  [1206]  56.07,50.81 0 top
R27  100k  [0603]  20.25,41.28 180 top
R28  0.01R  [0805]  29.88,45.03 180 top
R29  240Ω  [M0805]  154.12,79.86 270 top  (outside the outline)
R30  48Ω  [M0805]  157.42,93.49 270 top  (outside the outline)
R31  10k  [0603]  91.32,65.44 90 top
R32  10k  [0603]  72.33,116.65 270 top
R33  10  [1206]  92.36,46.53 180 top
R34  10  [1206]  79.06,45.04 0 top
R37  1M  [0603]  21.12,55.15 270 top
R38  1M  [0603]  18.38,55.15 270 top
R39  47k  [0603]  32.12,21.27 90 top
R40  47k  [0603]  56.38,57.28 180 top
R41  47k  [0603]  59.12,74.27 180 top
R42  9.53k  [0603]  59.91,57.3 0 top
R43  8.45k  [0603]  32.12,16.78 90 top
R44  2.74k  [0603]  63.12,74.27 0 top
R45  19.1k  [0603]  29.38,21.27 90 top
R46  100k  [0603]  27.12,21.27 270 top
R47  32.4k  [0603]  56.12,69.77 180 top
R48  100k  [0603]  59.12,71.52 0 top
R49  100k  [0603]  50.62,50.53 180 top
R50  7.15k  [0603]  55.38,53.28 180 top
R51  15k  [0603]  26.62,58.9 270 top
S1  EN11-HSM1BF20  [EN11HSM1BF20]  27.68,148.18 0 top  (outside the outline)
S2  TL3342F160QG  [SW_TL3342F160QG]  94.45,59.92 0 top
SCREEN1  OLED  [SIP-20]  78.02,141.63 0 top  (outside the outline)
SHUTTER  4N35S  [SOT23-6]  15.24,76.41 90 top
U1  TPD8S300RUKRRUK0020B_NV  [RUK0020B_NV]  13.75,47.4 0 top
U2  FT232RL-REEL  [SOP65P780X200-28N]  19.76,64.64 270 top
U3  CDCS502PWR  [SOP65P640X120-8N]  172.13,76.52 270 top  (outside the outline)
U4  LSM9DS1  [PQFN24P43_350X300X102L35X23N]  101.79,118.98 90 top
U5  TPS54336ADRCR  [DRC0010J]  51.75,72.52 0 top
U6  TPS54336ADRCR  [DRC0010J]  30.38,26.4 270 top
U7  TPS54336ADRCR  [DRC0010J]  50.5,56.28 0 top
U$27  CSD17309Q3  [DQG0008A]  36.25,43.9 270 top
U$28  CSD17309Q3  [DQG0008A]  40.75,43.9 270 top
U$29  TPS659821  [QFN50P800X800X100-57N]  23.25,48.9 0 top
X1  STEREOJACK  [STX3100]  0.52,67.6 0 top
Y1  7B-16.000MAAJ-T  [7B-16.000MAAJ-T_OSCSC500X320X105-4N]  177.66,76.75 180 top  (outside the outline)

## Tracks (layer width: path | path; a pad name or v marks a point on that pad's centre or on a via)
1.5V  (9 unrouted)
1.8V  (via drill 0.41)  (19 unrouted)
  Top 0.254: v36,61.15 36,62.88 C68.1
  Top 0.48: U$29.40 27.17,51.15
  Top 0.5: 27.17,51.15 v28.27,51.15
  Bottom 0.508: v28.27,51.15 28.27,53.42 29.46,54.61 29.58,54.61 30.04,55.07 30.04,55.19 v36,61.15
  pour Route3: 63.79,117.33 63.79,92.33 87.79,92.33 87.79,117.33
3.3V  (via drill 0.41)  (31 unrouted)
  Top 0.254: U1.10 16.08,44.47 R1.2 | U$29.42 29.03,54.03 29.25,54.03 | 29.25,54.03 R22.1 C66.1 39.81,61.98 40.61,61.98 40.74,62.11 40.74,62.92 44.23,66.4 47.12,66.4 | R1.2 17.16,43.07 17.16,42.38 16.5,41.72 C2.2 16.52,41.28 R27.2 | U$29.53 21.5,53.32 21.84,53.66 21.84,55.06 v23.47,56.68 | v29.25,55.4 29.25,54.03 | R1.2 16.33,45.23 v16.5,45.4 | L5.2 44.86,68.89 C44.1 47.12,66.4 | 47.12,66.4 C52.1 51.81,66.92 51.81,66.94 51.94,67.07 55.62,67.07 57.74,69.19 57.74,69.29 R48.2 | U2.17 16.83,59.98 v16.5,59.65 | C45.1 16.88,21.02 v16.75,21.15
  Top 0.635: R22.1 27.67,52.34 27.52,52.34 27.38,52.2 27.16,52.2
  Bottom 0.254: v29.25,55.4 27.97,56.68 v23.47,56.68 23.25,56.9 22.68,56.9 20.08,54.3 17.67,54.3 15.07,56.9 12.25,56.9 12.16,56.81 10.98,56.81 10.34,56.17 10.34,55.38 11.23,54.49 12.37,54.49 17.61,49.26 17.61,46.87 16.5,45.76 v16.5,45.4
  pour Route3 (isolate 0.635, rank 6): 0.5,135.17 0.5,0.52 132.04,0.62 132.09,135.17
3V3_VSENSE
  Top 0.254: U5.6 54.75,71.52 | 54.75,71.52 R48.1 | R48.1 | R47.2 54.75,70.3 54.75,71.52
5V  (via drill 0.41)  (9 unrouted)
  Top 0.254: U$29.28 U$29.27 25.99,43.49 C72.1 25.14,42.83 v24.59,42.52 | v23.5,39.4 23.62,39.28 C69.1 24.87,36.91 C46.1 | U2.20 18.78,59.43 v18.76,59.41 18.76,59.1 | v22,66.65 22.03,66.68 U2.4 | C46.1 26.75,34.78 C47.1 23.12,33.24 21.88,31.99 21.88,28.98 C51.1 24.05,26.86 25,25.9 25,22.05 R46.2 | L3.2 29.75,34.04 | 29.75,34.04 27.74,34.04 C46.1 | 29.75,34.04 28.12,32.41 28.12,30.34
  Top 0.635: v17.67,53.22 17.67,53.38 17.07,53.98 17.07,57.72 v17.75,58.4 | v18.1,45.98 18.44,45.65 18.45,45.65 18.45,45.6 19.34,45.6
  Bottom 0.254: v18.1,45.98 21.59,42.49 21.59,42.13 21.98,41.74 22.52,41.74 22.72,41.93 | v24.59,42.52 23.26,42.47 22.72,41.93 | 22.72,41.93 23.5,41.15 v23.5,39.4
  Bottom 0.635: v17.67,53.22 17.67,51.73 18.1,51.3 18.1,49.51 18.14,49.48 18.14,46.65 18.1,46.61 v18.1,45.98 20.58,43.5 20.85,43.5 21.4,42.95 21.4,42.05 21.9,41.55 22.6,41.55 23.52,42.47 v24.59,42.52 | v17.75,58.4 v18.76,59.41 18.76,63.41 v22,66.65
5V_VSENSE
  Top 0.254: U6.6 29.38,23.15 | 29.38,23.15 R45.2 | R45.2 | 29.38,23.15 28.15,23.15 R46.1
12V_VSENSE  (via drill 0.41)
  Top 0.254: U7.6 52.88,55.28 v53,55.15 | R50.2 54.4,53.4 v53,53.4 53,52.05 R49.1
  Bottom 0.254: v53,55.15 v53,53.4
ANTENNA_GND  (via drill 0.41)  (7 unrouted)
  Top 0.254: v115.83,129.02 115.83,128.87 115.96,128.73
  Top 1.575: IC1.35 117.69,123.17 | 117.69,123.17 IC1.36 116.11,123.17 | 118.24,121.48 119.72,121.48 120.27,122.03 120.27,122.19 | 118.24,121.48 117.69,122.03 117.69,123.17 | IC1.33 120.27,122.19 | 116.11,123.17 115.96,123.32 115.96,128.18 | 115.96,128.18 115.96,128.73 116.76,129.54 116.76,131.3 115.51,132.56 113.75,132.56 112.5,131.3 112.5,129.54 113.3,128.73 113.3,128.18 | 114.68,120.84 113.58,120.84 112.99,121.43 112.99,122.91 113.3,123.22 113.3,128.18 | 114.68,120.84 114.68,118.66 | 118.24,121.48 116.42,121.48 | 116.42,121.48 115.78,120.84 114.68,120.84 | 116.42,121.48 116.42,122.86 116.11,123.17 | 126.12,121.48 122.24,121.48 121.54,122.19 120.27,122.19 | 126.12,121.48 126.82,122.19 127.26,122.19 IC1.29 127.28,121.06 | IC1.28 127.28,121.06 | 126.12,121.48 126.54,121.06 127.28,121.06 | 126.12,121.48 126.12,121.04 125.59,120.51 125.59,119.03 126.05,118.57 IC1.26 | J5.4 112.09,128.73 112.39,128.73 112.39,128.18 113.3,128.18 | J5.5 113,132.96 113,132.66 112.39,132.66 112.39,131.81 | J5.2 116.26,132.96 116.26,132.66 116.87,132.66 116.87,131.81 | J5.3 117.17,128.73 116.87,128.73 116.87,128.18 115.96,128.18
  other vias: 112.73,131.22 112.73,129.77 113.43,129.02 113.28,126.57 113.28,124.77 115.98,124.77 115.98,126.57 116.58,129.77 116.53,131.22 114.63,132.47
  pour Route2: 109.13,134.67 109.13,104.67 131.63,104.67 131.63,134.67
  pour Route3: 109.13,133.92 109.13,104.67 131.63,104.67 131.63,133.92
  pour Bottom: 109.13,133.92 109.13,104.67 131.63,104.67 131.63,133.92
ANTENNA_IN  (1 unrouted)
  Top 0.787: J5.1 114.63,122.22 IC1.1 | IC1.1
BOOT0  (2 unrouted)
CAMERA_FOCUS  (1 unrouted)
CAMERA_GND
  Top 0.635: SHUTTER.5 14.13,76.14 14.71,76.14 14.95,75.9 14.95,73.39 14.68,73.12 14.1,73.12 FOCUS.5 13.57,72.58 12.99,72.58 10.3,69.89 10.3,65.02 8.22,62.93 X1.5
CAMERA_SHUTTER  (1 unrouted)
CLOCK  (5 unrouted)
ENC1_A  (1 unrouted)
ENC1_B  (1 unrouted)
ENC1_N  (1 unrouted)
ENC2_A  (1 unrouted)
ENC2_B  (1 unrouted)
ENC2_N  (1 unrouted)
ENC3_A  (1 unrouted)
ENC3_B  (1 unrouted)
ENC3_N  (1 unrouted)
ENCODER_A  (2 unrouted)
ENCODER_B  (2 unrouted)
ENCODER_SWITCH  (2 unrouted)
FOCUS
  Top 0.635: FOCUS.4 9.42,73.8 X1.2
GND  (via drill 0.41, 0.41 pad 0.45)  (101 unrouted)
  Top 0.254: 7.75,50.4 P1.B12 6.43,50.9 v5.5,50.9 5.5,52.3 P1.S4 | 7.75,50.4 7.88,50.4 P1.A1 | 7.75,44.4 P1.B1 5.5,42.97 v5.5,42.9 5.5,42.5 P1.S3 | 7.75,44.4 7.88,44.4 P1.A12 | 7.75,50.4 8.6,51.25 P1.S1 | 7.75,44.4 8.6,43.55 P1.S2 | C19.2 12.38,39.53 | U1.18 U1.21 | 13.25,46.9 12.95,46.6 U1.6 U1.7 | 13.25,46.9 U1.21 | U1.7 13.35,46.8 13.25,46.9 | U1.21 U1.8 U1.7 | U1.13 U1.21 | U1.7 13.35,45 v13.25,44.9 | U2.26 U2.25 21.8,61.25 21.8,61.86 21.67,61.99 19.79,61.99 19.66,61.86 19.66,61.25 U2.21 19.2,61.25 19.2,61.86 19.07,61.99 17.84,61.99 17.71,61.86 17.71,61.25 U2.18 17.48,61.92 v16.75,62.65 | U2.7 20.08,66.73 v20,66.65 | C73.2 15.88,57.03 v15.75,57.15 | R38.1 18.38,57.03 v18.25,57.15 | R37.1 21.12,57.03 v21,57.15 | C71.2 33.12,48.03 v33.25,47.9 | C70.2 38.88,49.28 v39.25,48.9 | C72.2 27.23,43.88 v27.5,44.15 | C37.2 v18.25,27.65 | C69.2 29.62,39.28 v29.75,39.4 | C65.2 28.88,67.52 v29,67.65 | C67.2 32.12,67.52 v32.25,67.65 | C68.2 35.88,67.27 v36,67.4 | C64.1 39.62,67.02 v39.75,67.4 | C66.2 36.12,54.03 v36.25,54.15 | C63.2 19.63,41.99 20.04,41.99 20.17,41.86 20.17,40.69 20.04,40.56 18.41,40.56 v17.75,39.9 | R21.1 11.12,60.03 v11.5,60.4 | 45.51,52.07 45.51,50.9 | 45.51,49.53 45.51,49.15 C48.2 | 50.67,55.82 50.5,55.98 U7.11 50.5,58.55 C43.1 51.22,60.87 C42.1 | 50.67,55.82 50.97,55.52 50.97,54.98 v50.5,54.52 | U7.3 U7.4 | U7.4 U7.5 | U7.4 49.14,55.82 50.67,55.82 | U6.4 U6.5 | U6.4 29.88,26.9 U6.11 | U5.4 U5.5 | U5.4 51.25,72.02 U5.11 | U6.11 | U6.11 30.08,26.4 29.62,25.93 29.23,25.93 28.77,26.4 v28.62,26.4 | U5.11 | U5.11 51.75,72.23 52.22,71.77 52.22,71.38 51.75,70.92 v51.75,70.77 | C50.2 32.25,50.9 v32.75,51.4 | C53.1 v62.56,53.8 C54.1
  Top 0.254: R50.1 55.5,54.01 v55.5,54.4 | R51.1 26.62,60.12 v27.75,60.24 | C58.2 v65.33,71.33 65.28,71.27 C57.2 | C44.2 49.12,68.77 v49.5,69.15 | C52.2 v53.75,66.4 | R47.1 56.97,70.64 v56.75,70.86 | 31.72,26.4 U6.11 | C47.2 26.75,31.27 C46.2 27,31.27 v27,30.15 | R39.1 32.12,19.27 v32.25,19.15 | R45.1 29.5,20.3 v29.5,19.15 | C51.2 v24,24.65 | C56.2 v29.38,14.9 29.38,14.38 C55.2 | C39.1 53.5,78.74 53.5,76.4 | 53.5,76.4 C38.1 53.63,76.4 v55,76.4 | U5.11 51.75,74.64 53.5,76.4 | 21.5,49.4 U$29.57 23.25,50.65 v24,51.4 | C45.2 23.38,21.02 v23.5,21.15 | U5.3 U5.4 | U6.3 U6.4 | v13.75,56.15 13.48,56.15 C62.1 | R41.1 60.25,74.55 v60.25,75.65 | R40.1 56.08,58.42 v55.85,58.42
  Top 0.508: IC1.15 119.63,106.67 | 122.22,105.42 123.67,106.88 123.67,107.26 IC1.17 124.69,108.28 124.69,108.66 124.89,108.86 125.87,108.86 125.97,108.77 126.88,108.77 | IC1.21 IC1.22 IC1.23 IC1.24 IC1.6 | IC1.21 127.79,110.66 128.17,110.66 128.37,110.46 128.37,109.48 128.17,109.28 127.79,109.28 IC1.19 126.88,108.77 | IC1.9 IC1.21 | IC1.10 125.68,109.97 | 125.68,109.97 126.88,108.77 | IC1.21 126.88,111.17 125.68,109.97
  Top 0.635: FOCUS.2 17.44,72.85 v19.02,73.63 | SHUTTER.2 17.96,76.41 v19.02,77.47 | C1.1 11.27,39.53 12.38,39.53 v12,39.15 12.35,39.5 C19.2 16.45,39.5 C2.1 17.4,39.55 v17.75,39.9 | D1.A 16.75,34.98 v16.75,36.65 | v13.25,27.65 C20.2 C35.2 | C36.2 C37.2 | C49.2 45.51,52.07 45.51,49.53 | 45.51,50.9 v46.75,50.9
  Top 1.016: 11.4,67.31 12.7,67.31 15.31,69.92 15.31,72.42 15.7,72.81 18.2,72.81 v19.02,73.63 | 31.72,26.4 32.49,26.4 C40.1 35.28,25.68 C41.1 | R20.2 76.17,43.14 v76.17,43.18 | R23.1 54.97,42.3 v55.85,43.18
  Route2 0.254: v5.5,50.9 5.85,51.25 5.85,52 6.25,52.4 6.25,53.9 6.75,54.4 7.5,54.4 | v5.5,42.9 5.5,40.9 6.75,39.65 | v13.25,44.9 13.75,44.4 14,44.4 | v16.75,62.65 17,62.9 17.5,62.9
  pour Route2 (isolate 0.635, rank 6): 0.5,0.52 132.09,0.52 132.34,135.17 0.5,135.17
  pour Top (no thermals): 69.29,110.58 69.29,98.58 81.29,98.58 81.29,110.58
HV_GATE1
  Top 0.254: U$27.4 34.06,46.64 U$29.31
HV_GATE2
  Top 0.254: U$29.32 27.3,47.01 36.54,47.01 38.12,45.43 U$28.4
HV_SOURCE
  Top 0.254: U$29.33 28.01,47.66 28.25,47.9 | U$29.34 28.01,48.14 28.25,47.9 | 28.25,47.9 30,47.9 | 30,47.9 30.15,47.9 | 31.52,49.28 33,49.28 33.75,49.28 | 33.75,49.28 34.26,49.28 | 33.75,49.28 34.13,49.66 34.37,49.9 | 33.76,50.03 36.75,53.03 36.8,53.03 | 42.74,56.28 L4.2 43.65,56.65 44.16,56.14 44.16,55.87 44.37,55.67 44.83,55.67 46.36,54.14 46.36,53.94 R49.2 | C50.1 30.3,48.2 30,47.9
  Top 0.635: 27.41,47.9 27.4,47.9 27.21,48.09 27.16,48.09 | 27.41,47.9 28.25,47.9 30.15,47.9 C71.1 | 27.41,47.9 27.21,47.71 27.16,47.71 | C71.1 30.27,50.88 C50.1 | C71.1 31.52,49.28 34.26,49.28 C70.1 | 33,49.28 33.76,50.03 | 33.76,50.03 34.13,49.66 | 33.76,50.03 33.81,50.03 36.8,53.03 40,53.03 | 40,53.03 C49.1 41.99,55.53 42.74,56.28 | 40,53.03 40,50.9 C48.1 43.14,49.03 44.58,47.59 46.18,47.59 46.42,47.83 46.42,48.99 47.95,50.53 R49.2
JTCK  (1 unrouted)
JTDI  (1 unrouted)
JTDO  (1 unrouted)
JTMS  (1 unrouted)
LDO_3V3
  Top 0.254: U$29.51 22.49,53.34 24.4,55.25 25.58,55.25 27.17,56.83 28.68,56.83 28.88,57.03 C65.1
N$1
  Top 0.254: U$29.55 20.75,52.81 | 20.75,52.81 U$29.54 | 20.75,52.81 20.75,53.93 R37.2
N$4  (via drill 0.41)
  Top 0.254: U$29.22 23.5,44.18 v23.89,43.79 | R27.1 21.98,42.4 v22.25,42.4
  Bottom 0.254: v22.25,42.4 23.64,43.79 v23.89,43.79
N$5
  Top 0.254: U$29.48 24.13,52.93 24.13,53.31 27.31,56.49 32.59,56.49 39.1,63 C64.2
N$7  (1 unrouted)
N$8  (1 unrouted)
N$11  (2 unrouted)
  Top 1.016: Q5.R 106.74,37.65 Q6.R
N$12  (2 unrouted)
  Top 1.016: Q11.R 84.07,20.77 Q12.R
N$13
  Top 1.016: Q14.R 80.97,37.65 Q13.R 80.62,39.46 R20.1 80.62,44.87 R34.2
N$14  (2 unrouted)
  Top 1.016: Q3.R 109.84,20.77 Q4.R
N$15
  Top 1.016: Q20.R 55.21,37.65 Q19.R 54.33,39.11 R23.2 51.61,42.13 R25.1
N$16  (2 unrouted)
  Top 1.016: Q21.R 58.31,20.77 Q22.R
N$17
  Top 0.635: FOCUS.1 R10.2
N$18
  Top 0.635: R9.2 SHUTTER.1
N$19  (2 unrouted)
N$20  (2 unrouted)
N$21  (2 unrouted)
N$22  (via drill 0.41)
  Top 0.254: U$29.19 U$29.20 22.63,44.85 22.63,44.12 23.62,43.13 24.17,43.13 24.55,43.52 24.55,44.07 24.5,44.12 | 24.25,44.37 24.13,44.49 24.13,44.87 U$29.23 | 24.25,44.37 | 24.25,44.37 24.5,44.37 | 24.5,44.37 25,44.37 | 25,44.37 25.24,44.37 25.37,44.49 25.37,44.85 U$29.26 25.62,45.1 | 24.5,44.12 24.25,44.37 | U$29.1 19.34,53.06 v19.25,52.9 | U$29.38 27.3,50.28 28.19,50.28 | U$29.41 27.58,51.64 27.74,51.81 28.54,51.81 28.93,51.42 28.93,50.87 28.34,50.28 28.19,50.28 | 24.5,44.12 24.5,44.37 | 25,44.37 25,44.04 v24.86,43.9 | v11.25,56.15 11.12,56.28 R21.2 | 28.19,50.28 v28.29,50.18
  Bottom 0.254: v24.86,43.9 24.86,47.54 | 24.86,47.54 v19.25,52.9 18.92,52.9 17.94,53.88 17.39,53.88 16.42,52.9 15,52.9 12.09,55.81 11.59,55.81 v11.25,56.15 | 24.86,47.54 27.5,50.18 v28.29,50.18
N$25  (2 unrouted)
N$28
  Top 0.254: U$27.5 U$27.6 U$27.7 U$27.8 U$28.5 U$28.6 U$28.7 U$28.8
N$30  (4 unrouted)
N$31
  Top 0.254: U$29.49 U$29.50
N$32  (2 unrouted)
N$34
  Top 0.254: 26.23,53.43 26.36,53.31 26.36,52.95 U$29.43 | 26.23,53.43 25.27,53.43 25.14,53.31 25.14,52.95 U$29.46 | 26.23,53.43 27.06,53.43 R22.2
N$35
  Top 0.254: U$29.2 19.2,51.78 18.84,51.78 18.38,52.25 R38.2
N$39
  Top 0.254: U5.10 53.9,74.27 R41.2
N$40
  Top 0.254: U6.10 32.12,24.25 R39.2
N$41
  Top 0.254: U7.10 R40.2
N$42
  Top 0.254: L4.1 47.75,56.65 | 47.75,56.65 48.98,56.65 U7.2 | 47.75,56.65 47.75,55.18 C61.2
N$43
  Top 0.254: C73.1 18.64,51.16 U$29.3
N$44
  Top 0.254: L3.1 30.88,32.01 30.88,28.65 | 30.88,28.65 U6.2 | 30.88,28.65 28.27,28.65 C60.2
N$45
  Top 0.254: U$29.52 22.01,53.34 24.31,55.65 25.5,55.65 26.62,56.78 R51.2
N$48
  Top 0.254: L5.1 49.75,73.02 | 49.75,73.02 U5.2 | C59.2 49.75,70.67 49.75,73.02
N$49
  Top 0.254: C61.1 52.47,54.4 54,54.4 54.5,54.9 54.5,56.15 53.88,56.78 U7.9
N$50  (via drill 0.41)
  Top 0.254: C59.1 54,70.42 v54,70.86 | U5.9 53.31,73.19 53.54,73.19 53.8,73.45 v54.01,73.45
  Bottom 0.254: v54,70.86 v54,73.44 v54.01,73.45
N$52  (via drill 0.41)
  Top 0.254: U$29.56 20,54.77 v19.81,54.96 | v32.25,61.4 32.12,61.53 C67.1
  Bottom 0.254: v19.81,54.96 26.25,61.4 v32.25,61.4
N$53  (via drill 0.41)
  Top 0.254: U6.9 v30.88,24.04 | v28.5,24.4 27.35,25.55 C60.1
  Bottom 0.254: v30.88,24.04 28.86,24.04 v28.5,24.4
N$54
  Top 0.254: C53.2 59.06,54 R42.1
N$57  (via drill 0.41)
  Top 0.254: U7.7 52.06,55.94 52.29,55.94 52.47,56.12 v53.5,56.12 | R42.2 61.78,57.3 | 61.78,57.3 62.06,57.3 C54.2 | v61.28,55.93 61.78,56.43 61.78,57.3
  Bottom 0.254: v53.5,56.12 53.69,55.93 v61.28,55.93
N$58
  Top 0.254: R43.1 32.12,14.62 C55.1
N$59
  Top 0.254: R43.2 29.58,17.62 C56.1 30.16,18.21 30.16,22.7 29.88,22.98 U6.7
N$62
  Top 0.254: R44.1 62.28,71.47 C57.1
N$63  (via drill 0.41)
  Top 0.254: C58.1 65.28,74.27 R44.2 63.97,72.88 v63.75,72.65 | v61,72.65 60.59,72.24 57.64,72.24 57.42,72.02 U5.7
  Bottom 0.254: v61,72.65 v63.75,72.65
N$64
  Top 0.254: U1.9 14.15,44.92 R1.1
N$66  (via drill 0.41)
  Top 0.254: v11,46.94 11.46,47.4 U1.3 | v11.75,44.65 11.75,43 C1.2
  Bottom 0.254: v11,46.94 11.75,46.19 v11.75,44.65
NJTRST  (2 unrouted)
NRST  (via drill 0.41)  (6 unrouted)
  Top 0.254: U2.19 18.13,59.71 18.1,59.69 18.1,59.14 18.49,58.75 22.97,58.75 24.4,60.18 24.4,67.29 | 62.17,80.74 v54.5,80.74
NSS429  (1 unrouted)
PRE_VBUS  (via drill 0.41)
  Top 0.254: U$28.3 U$28.2 41.5,45.43 | 41.5,45.43 U$28.1 | 41.5,45.43 41.5,45.33 42.24,44.59 42.24,41.91 41.98,41.65 31.72,41.65 28.93,41.65 28.77,41.81 28.23,41.81 28.07,41.65 24.23,41.65 | C19.1 11.8,42.3 11.22,41.72 11.22,41.36 10.92,41.07 9.91,41.07 9.78,40.94 9.78,40.28 FB1.1
  Top 0.406: 21.5,44.45 U$29.18 U$29.17 | U$29.17 20.99,44.45 | 20.99,44.45 21.45,44.45 21.5,44.45 | U$29.17 20.99,44.96 21.5,44.45 | 21.5,44.45 21.5,43.65 | 21.5,43.65 | 21.5,43.65 20.99,43.65 20.99,44.45
  Top 0.635: C19.1 13.98,42.65 v16.5,42.65 | 21.5,43.65 v20.5,42.65 | 21.5,43.65 21.5,44.18 21.45,44.18 21.45,44.45 | 21.5,43.65 22.23,43.65 24.23,41.65 31.72,41.65 34.75,41.65 34.81,41.59 42.19,41.59 42.43,41.83 42.43,44.67 41.73,45.38 U$28.1 U$28.3
  Bottom 0.635: v20.5,42.65 v16.5,42.65
REF0  (1 unrouted)
REF1  (1 unrouted)
REF2  (1 unrouted)
S1_BMA1  (1 unrouted)
  Top 2.54: Q4.C Q2.C 117.14,12.67 J4.2
S1_BMA2  (1 unrouted)
  Top 2.54: Q3.C Q1.C 99.44,10.19 J4.1
S1_BMB1  (via drill 0.41)  (1 unrouted)
  Top 1.016: v116.81,41.91 v117.44,41.28 | v117.44,41.28 v118.08,40.64 | v118.08,41.91 v116.81,41.91 | v115.54,40.64 v116.18,41.28 v116.81,41.91 | v116.81,41.91 v115.54,41.91 v115.54,40.64 | v115.54,40.64 v118.08,40.64 | v118.08,40.64 v118.08,41.91 | v118.08,41.91 v117.44,41.28 | v115.54,40.64 115.54,39.37 | v118.08,40.64 118.08,39.37
  Top 2.54: Q8.C 117.14,34.29 | 117.14,34.29 Q6.C | v116.81,40.64 116.81,34.62 117.14,34.29
  Bottom 1.016: v115.54,40.64 v116.81,40.64 v118.08,40.64 v118.08,41.91 v116.81,41.91 | v115.54,40.64 v115.54,41.91 v116.81,41.91 | v115.54,40.64 v116.81,41.91
  Bottom 2.54: J3.2 101.53,7.62 111.73,7.62 116.81,12.7 v116.81,40.64
S1_BMB2  (via drill 0.41)  (2 unrouted)
  Top 1.016: v99.03,40.64 v100.3,40.64 | v100.3,41.91 v99.03,41.91 | v97.76,41.91 v97.76,40.64 97.76,39.37 | v99.03,40.64 v99.67,41.28 v100.3,41.91 | v99.03,40.64 v98.39,41.28 v97.76,41.91 | v100.3,40.64 100.3,39.37 | v100.3,40.64 v100.3,41.91 | v100.3,41.91 v97.76,41.91
  Top 2.54: 100.3,29.21 99.44,30.07 Q5.C 99.44,40.23 v99.03,40.64
  Bottom 1.016: v99.03,40.64 v98.39,41.28 v97.76,41.91 | v100.3,41.91 v99.67,41.28 | v99.67,41.28 v99.03,40.64 | v97.76,41.91 v97.76,40.64 v99.03,40.64 | v99.03,40.64 v99.03,41.91 | v99.03,41.91 v97.76,41.91 | v99.03,41.91 v100.3,41.91 | v100.3,41.91 v100.3,40.64 | v100.3,40.64 v99.03,40.64 | v99.67,41.28 v100.3,40.64
  Bottom 2.54: v99.03,40.64 99.03,10.12 J3.1
S1_HA1  (via drill 0.41)  (1 unrouted)
  Top 0.254: Q2.L 110.85,15.24 v111.73,15.24
S1_HA2  (via drill 0.41)  (1 unrouted)
  Top 0.254: Q1.L 105.73,12.7 v105.38,12.7
S1_HB1  (via drill 0.41)  (1 unrouted)
  Top 0.254: Q8.L 109.84,29.83 v110.46,29.21
S1_HB2  (via drill 0.41)  (1 unrouted)
  Top 0.254: Q7.L 105.73,27.94 v105.38,27.94
S1_LA1  (via drill 0.41)  (1 unrouted)
  Top 0.254: Q4.L 110.85,22.86 v111.73,22.86
S1_LA2  (via drill 0.41)  (1 unrouted)
  Top 0.254: Q3.L 105.73,20.32 v105.38,20.32
S1_LB1  (via drill 0.41)  (1 unrouted)
  Top 0.254: 109.84,38.72 Q6.L 109.84,37.45 v110.46,36.83
S1_LB2  (via drill 0.41)  (1 unrouted)
  Top 0.254: Q5.L 105.73,35.56 v105.38,35.56
S1_SRA  (1 unrouted)
S1_SRB  (1 unrouted)
S1_VHS  (1 unrouted)
S2_BMA1  (1 unrouted)
  Top 2.54: Q12.C Q10.C 88.41,11.01 J10.2
S2_BMA2  (1 unrouted)
  Top 2.54: Q11.C Q9.C 82.56,5.08 J10.1
S2_BMB1  (via drill 0.41)  (1 unrouted)
  Top 1.016: v91.41,40.64 v91.41,41.91 | v92.68,40.64 v92.68,41.91 v90.14,41.91 v90.14,40.64 90.14,38.1 v92.68,40.64 | v92.68,40.64 92.68,39.37
  Top 2.54: Q14.C 91.37,34.29 | 91.37,34.29 Q16.C | v91.41,40.64 91.41,34.33 91.37,34.29
  Bottom 1.016: v91.41,41.91 v90.14,41.91 | v90.14,40.64 v91.41,40.64 | v91.41,40.64 v92.68,40.64 | v92.05,41.28 v91.41,40.64 | v91.41,40.64 v90.78,41.28 | v92.68,41.91 v90.14,41.91 | v90.14,41.91 v90.14,40.64 | v90.14,40.64 v92.68,40.64 | v92.68,40.64 v92.68,41.91 | v92.05,41.28 v90.78,41.28 | v90.14,41.91 v90.78,41.28 | v92.05,41.28 v92.68,41.91
  Bottom 2.54: J9.2 80.39,7.62 86.33,7.62 91.41,12.7 v91.41,40.64
S2_BMB2  (via drill 0.41)  (1 unrouted)
  Top 1.016: v73.63,40.64 v73.63,41.91 | v74.9,41.91 v74.9,40.64 74.9,39.37 | v72.36,40.64 v72.36,41.91 v74.9,41.91 | v74.9,41.91 v73.63,41.91 | v73.63,41.91 v72.36,40.64 | v72.36,40.64 72.36,39.37
  Top 2.54: Q15.C Q13.C 73.67,40.6 v73.63,40.64
  Bottom 1.016: v73.63,40.64 v73,41.28 v72.36,41.91 | v73.63,41.91 v74.9,41.91 | v74.9,41.91 v74.9,40.64 | v74.9,40.64 v73.63,40.64 | v73.63,40.64 v74.27,41.28 | v74.9,40.64 v74.27,41.28 | v74.9,41.91 v74.27,41.28 | v73.63,41.91 v74.27,41.28 | v73.63,41.91 v73.63,40.64 | v73.63,40.64 v72.36,40.64 v72.36,41.91 | v72.36,41.91 v73.63,41.91
  Bottom 2.54: v73.63,40.64 73.63,5.86 J9.1
S2_HA1  (via drill 0.41)  (1 unrouted)
  Top 0.254: Q10.L 85.06,15.26 v85.06,13.97
S2_HA2  (via drill 0.41)  (1 unrouted)
  Top 0.254: v79.98,13.97 80.97,12.98 Q9.L
S2_HB1  (via drill 0.41)  (1 unrouted)
  Top 0.254: 84.07,31.47 Q16.L 85.06,30.5 v85.06,29.21
S2_HB2  (via drill 0.41)  (1 unrouted)
  Top 0.254: 80.97,26.95 Q15.L 79.96,27.94 v78.71,27.94
S2_LA1  (via drill 0.41)  (1 unrouted)
  Top 0.254: Q12.L 85.06,22.88 v85.06,21.59
S2_LA2  (via drill 0.41)  (1 unrouted)
  Top 0.254: Q11.L 79.98,20.3 v79.98,21.59
S2_LB1  (via drill 0.41)  (1 unrouted)
  Top 0.254: Q14.L 84.07,37.82 v85.06,36.83
S2_LB2  (via drill 0.41)  (1 unrouted)
  Top 0.254: Q13.L 80.97,34.57 79.7,34.57 v78.71,35.56
S2_SRA  (1 unrouted)
S2_SRB  (1 unrouted)
S2_VHS  (1 unrouted)
S3_BMA1  (via drill 0.41)  (1 unrouted)
  Top 1.016: v66.01,40.64 v67.28,40.64 | v66.01,40.64 v64.74,40.64 | v64.74,40.64 v64.74,41.91 v66.01,41.91 | v64.74,40.64 v65.38,41.28 v66.01,41.91 | v66.01,41.91 v67.28,41.91 v67.28,40.64 | v66.64,41.28 v66.01,40.64 | v67.28,40.64 67.28,39.37 65.61,37.7 Q20.C
  Top 2.54: Q18.C Q20.C 65.61,40.24 v66.01,40.64
  Bottom 1.016: v66.01,40.64 v66.01,41.91 | v67.28,41.91 v67.28,40.64 v66.01,40.64 | v66.01,40.64 v66.64,41.28 | v66.64,41.28 v67.28,41.91 | v64.74,41.91 v64.74,40.64 v66.01,40.64 | v66.01,40.64 v65.38,41.28 v64.74,41.91 | v64.74,41.91 v66.01,41.91 | v66.01,41.91 v67.28,41.91 | v66.01,41.91 v66.64,41.28
  Bottom 2.54: J12.2 67.28,39.37 v66.01,40.64
S3_BMA2  (via drill 0.41)  (1 unrouted)
  Top 1.016: v48.23,40.64 v48.87,41.28 v49.5,41.91 | v46.96,41.91 v48.23,41.91 v49.5,41.91 | v47.59,41.28 v46.96,41.91 | v48.23,40.64 v46.96,40.64 | v48.23,40.64 v49.5,40.64 | v49.5,40.64 v49.5,41.91 | v46.96,41.91 v46.96,40.64 | v46.96,40.64 46.96,39.37 | v49.5,40.64 49.5,39.37
  Top 2.54: Q17.C Q19.C 48.23,37.15 v48.23,40.64
  Bottom 1.016: v49.5,41.91 v48.87,41.28 v48.23,40.64 | v48.23,40.64 v47.59,41.28 | v46.96,41.91 v47.59,41.28 | v46.96,41.91 v48.23,41.91 | v48.23,41.91 v49.5,41.91 | v48.23,41.91 v48.23,40.64 | v46.96,40.64 v46.96,41.91 | v46.96,40.64 v47.59,41.28 | v46.96,40.64 v48.23,40.64 | v48.23,40.64 v49.5,40.64 v49.5,41.91
  Bottom 2.54: J12.1 58.47,8.89 53.31,8.89 48.23,13.97 v48.23,40.64
S3_BMB1  (1 unrouted)
  Top 2.54: Q22.C 64.74,20.72 64.74,13.97 Q24.C J11.2
S3_BMB2  (1 unrouted)
  Top 2.54: Q21.C Q23.C 47.91,8.89 J11.1
S3_HA1  (via drill 0.41)  (1 unrouted)
  Top 0.254: Q18.L 59.32,30.48 v59.66,30.48
S3_HA2  (via drill 0.41)  (1 unrouted)
  Top 0.254: Q17.L 54.2,27.94 v53.31,27.94
S3_HB1  (via drill 0.41)  (1 unrouted)
  Top 0.254: Q24.L 59.32,15.24 v59.66,15.24
S3_HB2  (via drill 0.41)  (1 unrouted)
  Top 0.254: Q23.L 55.21,13.34 v54.58,13.97
S3_LA1  (via drill 0.41)  (1 unrouted)
  Top 0.254: 58.39,39.03 Q20.L 59.32,38.1 v59.66,38.1
S3_LA2  (via drill 0.41)  (1 unrouted)
  Top 0.254: 55.21,34.93 Q19.L 54.2,35.56 v53.31,35.56
S3_LB1  (via drill 0.41)  (1 unrouted)
  Top 0.254: Q22.L 58.31,24.21 v59.66,22.86
S3_LB2  (via drill 0.41)  (1 unrouted)
  Top 0.254: 55.21,19.69 Q21.L 55.21,20.96 v54.58,21.59
S3_SRA  (1 unrouted)
S3_SRB  (1 unrouted)
S3_VHS  (1 unrouted)
SDO429  (1 unrouted)
SENSEN
  Top 0.254: U$27.1 U$27.2 36.25,45.43 | U$27.3 36.25,45.43 | U$29.29 27.78,45.03 R28.2 29.47,45.03 30.29,44.21 31.26,44.21 31.89,44.83 35.66,44.83 36.25,45.43
SENSEP  (via drill 0.41)
  Top 0.254: U$29.30 31.82,46.16 v32,45.98 31.05,45.03 R28.1 | v32.75,38.94 C13.1
  Bottom 0.254: v32,45.98 32.75,45.23 v32.75,38.94
SHUTTER
  Top 0.635: X1.1 6.69,70.97 6.69,73.23 10.81,77.36 SHUTTER.4
SPI1_MISO  (1 unrouted)
SPI1_MOSI  (2 unrouted)
SPI1_NSS  (1 unrouted)
SPI1_SCK  (2 unrouted)
SPI2_MISO  (1 unrouted)
SPI2_MOSI  (1 unrouted)
SPI2_NSS  (1 unrouted)
SPI2_SCK  (1 unrouted)
SPI3_MISO  (2 unrouted)
SPI3_MOSI  (1 unrouted)
SPI3_NSS1  (1 unrouted)
SPI3_NSS2  (1 unrouted)
SPI3_SCK  (1 unrouted)
SPI_STEPPER_1_SDO  (1 unrouted)
SPI_STEPPER_2_SDO  (1 unrouted)
SPI_STEPPER_3_SDO  (1 unrouted)
SPI_STEPPER_CS  (4 unrouted)
SPI_STEPPER_SCK  (3 unrouted)
SPI_STEPPER_SDO  (1 unrouted)
USART1_RX  (1 unrouted)
  Top 0.254: IC1.30 125.38,124.67 125.5,124.8 | 125.5,124.8 125.54,124.83 125.63,124.83 | 125.5,124.8 128.5,124.8 129.54,123.76 129.54,105.08 128.97,104.51
USART1_TX  (1 unrouted)
  Top 0.254: IC1.31 124.18,124.97 124.38,125.17 128.63,125.17 129.88,123.92 129.88,104.92 129.13,104.17
USART2_CTS  (1 unrouted)
USART2_RTS  (1 unrouted)
USART2_RX  (1 unrouted)
USART2_TX  (1 unrouted)
USB_SLAVE_A_D_N
  Top 0.254: P1.A7 8.49,47.15 10.62,49.28 11.13,49.28 11.25,49.4 11.25,50.41 11.62,50.78 12.26,50.78 13.02,50.02 13.12,50.02 | 13.12,50.02 13.35,49.54 U1.19 | 13.12,50.02 14.58,51.48 14.58,51.49 15.07,51.98 15.43,51.98 18.18,49.23 19.26,49.23 U$29.7
USB_SLAVE_A_D_P  (via drill 0.41)
  Top 0.254: P1.A6 8.51,47.65 10.38,49.52 10.38,50.03 v10.5,50.15 | v12.15,49.9 12.51,49.9 12.95,49.46 U1.20 | v13.05,50.95 13.56,50.95 14.93,52.32 15.57,52.32 18.32,49.57 19.25,49.57 U$29.6
  Bottom 0.254: v10.5,50.15 11.25,50.15 11.25,50.4 11.65,50.8 12.15,50.8 | 12.15,50.8 12.4,50.95 v13.05,50.95 | 12.15,50.8 v12.15,49.9
USB_SLAVE_B_D_N  (via drill 0.41)
  Top 0.254: P1.B7 v5.5,47.9 | U1.16 14.55,49.36 15.01,49.81 v15.01,49.89 15.01,50.66 15.07,50.73 15.43,50.73 17.93,48.23 19.25,48.23 U$29.9
  Bottom 0.254: v15.01,49.89 15.01,50.64 13.57,52.07 10.18,52.07 6.01,47.9 v5.5,47.9
USB_SLAVE_B_D_P  (via drill 0.41)
  Top 0.254: P1.B6 v5.5,46.9 | U1.17 14.15,49.5 14,49.65 v14,49.9 14.08,49.9 14.58,50.4 14.58,50.72 14.93,51.07 15.57,51.07 18.07,48.57 19.26,48.57 U$29.8
  Bottom 0.254: v5.5,46.9 v5.49,46.9 10.32,51.73 13.43,51.73 14.13,51.03 14.13,50.03 v14,49.9
USB_SLAVE_C_CC1  (via drill 0.41)
  Top 0.254: U1.4 12,47 10.77,45.77 v9.09,45.77 | P1.A5 8.26,48.28 8.62,48.28 9.09,48.75 v9.09,49.4
  Bottom 0.254: v9.09,45.77 v9.09,49.4
USB_SLAVE_C_CC2  (via drill 0.41)
  Top 0.254: U1.5 10.86,45.11 v9.96,45.11 | v5.57,45.86 6.11,46.4 P1.B5
  Bottom 0.254: v9.96,45.11 8.82,45.11 8.03,45.46 5.97,45.46 v5.57,45.86
USB_SLAVE_C_SBU1
  Top 0.254: P1.A8 8.26,46.78 8.72,46.78 10.13,48.2 U1.1
USB_SLAVE_C_SBU2  (via drill 0.41)
  Top 0.254: 11.6,47.8 11.75,47.8 | 11.75,47.8 U1.2 | 11.75,47.8 11.69,47.74 10.87,47.74 10.07,46.94 v10.04,46.94 | P1.B8 5.93,48.4 5.77,48.56 5.09,48.56 v4.94,48.71
  Bottom 0.254: v10.04,46.94 10.04,46.37 10.75,45.65 10.75,44.9 10.25,44.4 9.04,44.4 8.09,44.85 5.45,44.85 4.84,45.45 4.84,48.17 4.94,48.28 v4.94,48.71
USB_SLAVE_CC1  (via drill 0.41)
  Top 0.254: U$29.12 18.5,46.64 | 18.5,46.64 18.01,46.64 17.65,47 16.8,47 | U$29.13 18.98,46.16 18.5,46.64 | 16.8,47 U1.12 | 16.8,47 v16.94,47.14 | v12.75,52.73 C62.2
  Bottom 0.254: v12.75,52.73 13.07,52.41 13.96,52.41 16.94,49.43 v16.94,47.14
USB_SLAVE_CC2
  Top 0.254: U1.11 16.55,46.6 18.16,44.99 U$29.15 | U$29.16 U$29.15 | C63.1 20,44.37 U$29.15
USB_SLAVE_D_N
  Top 0.254: U$29.5 18.26,50.15 15.68,52.73 15.18,52.73 14.58,53.33 14.58,61.97 14.93,62.32 15.56,62.32 16.18,61.71 U2.16
USB_SLAVE_D_P
  Top 0.254: U$29.4 18.24,50.65 15.82,53.07 15.32,53.07 14.92,53.47 14.92,61.83 15.07,61.98 15.42,61.98 15.53,61.87 U2.15
USB_SLAVE_SBU1
  Top 0.254: U1.15 17.47,48.2 17.9,47.77 19.22,47.77 U$29.10
USB_SLAVE_SBU2
  Top 0.254: U1.14 17.39,47.8 17.9,47.29 19.2,47.29 U$29.11
USB_SLAVE_VBUS
  Top 0.254: P1.A4 8,48.78 7.64,48.78 7.52,48.9 P1.B9 5.92,48.9 5.45,49.37 4.67,49.37 4.28,48.98 4.28,46.01 5.2,45.1 5.75,45.1 6.55,45.9 P1.B4 7.52,45.9 7.64,46.02 8,46.02 P1.A9
VBUS
  Top 0.254: 8.25,36.83 FB1.2 | C20.1 C35.1
  Top 0.635: C36.1 C37.1 15.27,27.82 13.94,29.15 11.77,29.15 C20.1 10.27,33.5 D1.C 8.25,36.08 8.25,36.83
VCC  (via drill 0.41)  (8 unrouted)
  Top 0.254: C43.2 49.51,59.38 | 49.51,59.38 49.49,59.55 | C42.2 49.49,59.39 49.51,59.38 | U5.1 50.35,75.92 50.33,75.9 50,75.9 v43.5,75.9 | C39.2 49.99,78.99 C38.2 | 49.1,58.85 U7.1 49.08,57.3 49.08,57.5
  Top 0.635: C40.2 31.73,28.16 31.41,27.83 31.41,27.8
  Top 1.016: v43.5,64.15 43.5,61.9 v46.75,58.65 47.9,57.5 49.08,57.5 49.08,57.72 49.1,57.74 49.1,58.85 C43.2 49.49,59.3 C42.2 | v43.5,75.9 49.62,75.9 C38.2 50.35,75.92 50.35,73.99 50.33,73.97 50.33,73.75 | C39.2 50,79 50,75.9 | C41.2 36.84,28.16 C40.2 34.25,34.65 36.91,37.31 39.26,37.31 47.34,45.39 47.34,47.74 v48.5,48.9 48.65,48.9 50.43,47.12 | Q15.R 80.97,30.03 83.42,27.57 | 83.42,27.57 Q16.R 85.6,25.4 | Q24.R 58.31,13.15 Q23.R 55.21,16.51 53.31,18.41 53.31,24.13 52.04,25.4 | Q10.R 84.07,13.15 Q9.R 78.71,18.51 78.71,23.19 77.02,24.89 76.68,24.89 76.17,25.4 | Q2.R 109.84,13.15 Q1.R 104.11,18.88 104.11,24.13 102.84,25.4 | Q7.R 106.74,30.03 Q8.R | C14.1 50.43,47.12 | 50.43,47.12 C17.1 | 50.74,25.4 51.61,26.26 51.61,27.89 Q17.R 55.21,30.03 Q18.R 59.84,25.4 | 50.74,25.4 41.88,25.4 | 83.42,27.57 82.37,26.52 82.37,26.18 81.58,25.4 | 59.84,25.4 76.17,25.4 | 76.17,25.4 81.58,25.4 | 85.6,25.4 102.84,25.4 | 102.84,25.4 108.31,25.4 | 52.04,25.4 50.74,25.4 | 52.04,25.4 59.84,25.4 | 81.58,25.4 85.6,25.4
  Top 1.27: +.1 39.34,16.21 | 36.84,28.16 38.05,26.95 38.42,26.95 38.7,26.67 39.34,26.67 39.34,25.4 41.88,25.4 108.31,25.4 Q8.R
  Top 2.54: J1.GND 21.07,6.95 +.1 41.88,18.75 41.88,25.4
  Bottom 1.016: v48.5,48.9 48.5,56.4 46.75,58.15 v46.75,58.65 | v43.5,64.15 v43.5,75.9
XIN  (1 unrouted)
XOUT  (1 unrouted)

## Text on the board
tPlace: JTAG | Panobot | Version 0.1 | Copyright Mel McCalla | All rights reserved | 5V | A | B | Z | GND | Enc 3 | 5V | A | B | Z | GND | Enc 2 | 5V | A | B | Z | GND | Enc 1